# EAGLE design permamote (EAGLE 9.1.1)
AUTHOR: NEAL JACKSON; REV: B; TITLE: PERMAMOTE

## Sheet 1 of 4
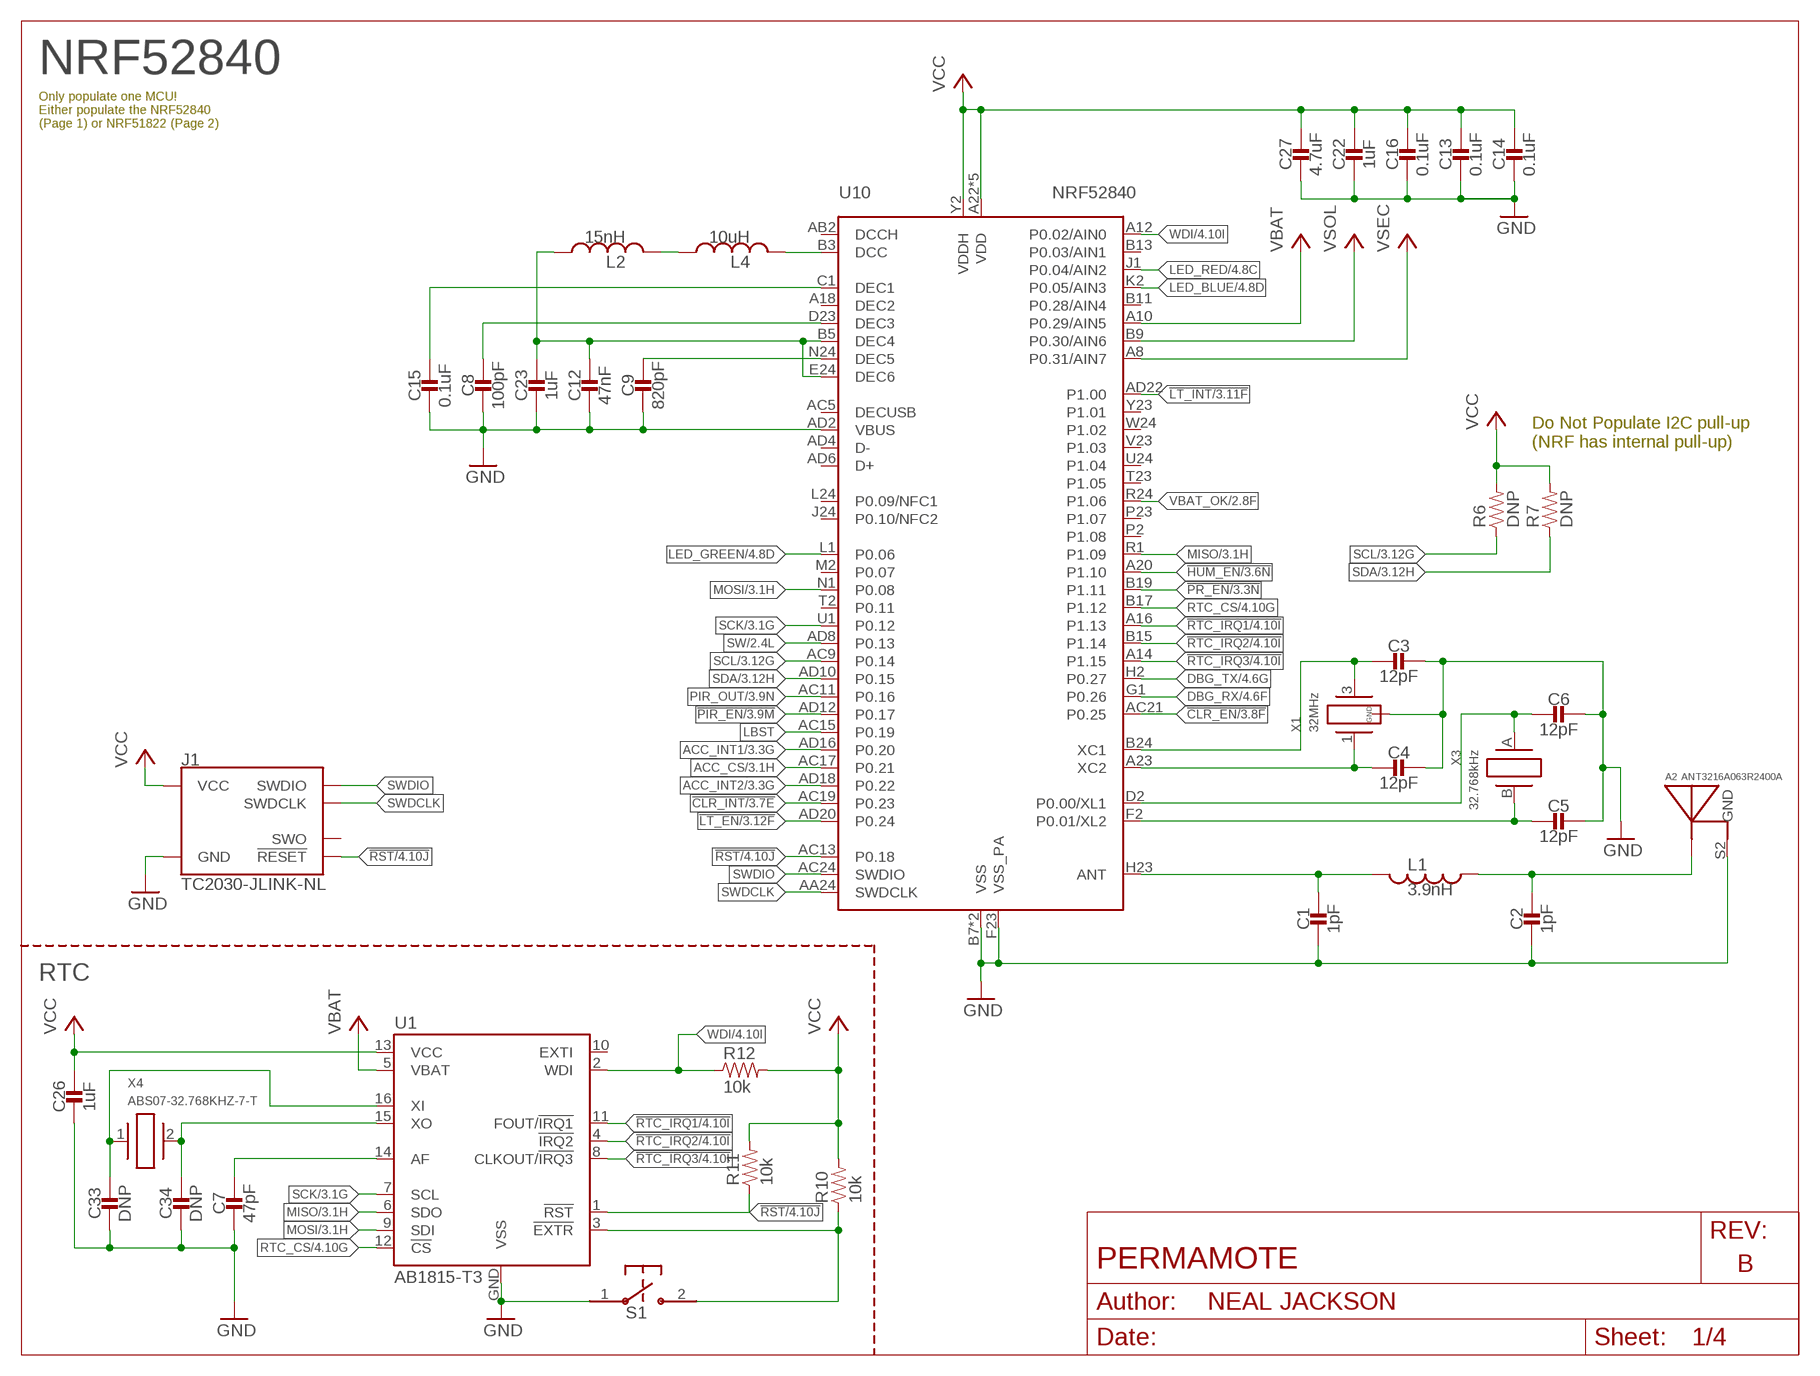
[diagram p0: schematic, sheet 1]

### Parts
A2  ANT3216A063R2400A  [ANT3216A063R2400A]
C1  1pF  CAPACITOR0402_CAP  [0402_CAP]
C2  1pF  CAPACITOR0402_CAP  [0402_CAP]
C3  12pF  CAPACITOR0402_CAP  [0402_CAP]
C4  12pF  CAPACITOR0402_CAP  [0402_CAP]
C5  12pF  CAPACITOR0402_CAP  [0402_CAP]
C6  12pF  CAPACITOR0402_CAP  [0402_CAP]
C7  47pF  CAPACITOR0402_CAP  [0402_CAP]
C8  100pF  CAPACITOR0402_CAP  [0402_CAP]
C9  820pF  CAPACITOR0402_CAP  [0402_CAP]
C12  47nF  CAPACITOR0402_CAP  [0402_CAP]
C13  0.1uF  CAPACITOR0402_CAP  [0402_CAP]
C14  0.1uF  CAPACITOR0402_CAP  [0402_CAP]
C15  0.1uF  CAPACITOR0402_CAP  [0402_CAP]
C16  0.1uF  CAPACITOR0402_CAP  [0402_CAP]
C22  1uF  CAPACITOR0402_CAP  [0402_CAP]
C23  1uF  CAPACITOR0402_CAP  [0402_CAP]
C26  1uF  CAPACITOR0402_CAP  [0402_CAP]
C27  4.7uF  CAPACITOR0402_CAP  [0402_CAP]
C33  DNP  CAPACITOR0402_CAP  [0402_CAP]
C34  DNP  CAPACITOR0402_CAP  [0402_CAP]
J1  TC2030-JLINK-NL  [TC2030-IDC-NL]
L1  3.9nH  INDUCTOR0402  [0402_CAP]
L2  15nH  INDUCTOR0402  [0402_CAP]
L4  10uH  INDUCTOR0603  [0603_CAP]
R6  DNP  RESISTOR0402_RES  [0402_RES]
R7  DNP  RESISTOR0402_RES  [0402_RES]
R10  10k  RESISTOR0402_RES  [0402_RES]
R11  10k  RESISTOR0402_RES  [0402_RES]
R12  10k  RESISTOR0402_RES  [0402_RES]
S1  B3U-1000P  [B3U-1000P]
U1  AB1815-T3  [QFN-16-3MM]
U10  NRF52840  [AQFN73]
X1  32MHz  7V-32.000MAHV-T  [TXC-7V]
X3  32.768kHz  ABS05-32.768KHZ-9-T  [ABS05]
X4  ABS07-32.768KHZ-7-T  [2-SMD]

### Nets
!CLR_EN: U10.AC21(P0.25) ; also sheet 3,4
!CLR_INT: U10.AC19(P0.23) ; also sheet 3,4
!HUM_EN: U10.A20(P1.10) ; also sheet 3,4
!LT_EN: U10.AD20(P0.24) ; also sheet 3,4
!LT_INT: U10.AD22(P1.00) ; also sheet 3,4
!PIR_EN: U10.AD12(P0.17) ; also sheet 3,4
!PR_EN: U10.B19(P1.11) ; also sheet 3,4
!RST: J1.3(!RESET) R11.1 U1.1(!RST) U10.AC13(P0.18) ; also sheet 4
!RTC_EXTR: R10.1 S1.2 U1.3(!EXTR)
!RTC_IRQ1: U1.11(FOUT/!IRQ1) U10.A16(P1.13) ; also sheet 4
!RTC_IRQ2: U1.4(!IRQ2) U10.B15(P1.14) ; also sheet 4
!RTC_IRQ3: U1.8(CLKOUT/!IRQ3) U10.A14(P1.15) ; also sheet 4
ACC_CS: U10.AC17(P0.21) ; also sheet 3,4
ACC_INT1: U10.AD16(P0.20) ; also sheet 3,4
ACC_INT2: U10.AD18(P0.22) ; also sheet 3,4
DBG_RX: U10.G1(P0.26) ; also sheet 4
DBG_TX: U10.H2(P0.27) ; also sheet 4
GND: A2.S2(GND) C1.2 C2.2 C3.1 C4.1 C5.1 C6.1 C7.2 C8.2 C9.2 C12.2 C13.2 C14.2 C15.2 C16.2 C22.2 C23.2 C26.2 C27.2 C33.2 C34.2 J1.5(GND) S1.1 U1.GND(VSS) U10.AD2(VBUS) U10.B7(VSS) U10.F23(VSS_PA) U10.GND(VSS) X1.2(GND) X1.4(GND) ; also sheet 2,3,4
LBST: U10.AC15(P0.19) ; also sheet 2
LED_BLUE: U10.K2(P0.05/AIN3) ; also sheet 4
LED_GREEN: U10.L1(P0.06) ; also sheet 4
LED_RED: U10.J1(P0.04/AIN2) ; also sheet 4
MISO: U1.6(SDO) U10.R1(P1.09) ; also sheet 3,4
MOSI: U1.9(SDI) U10.N1(P0.08) ; also sheet 3,4
N$1: C9.1 U10.N24(DEC5)
N$2: C15.1 U10.C1(DEC1)
N$3: C12.1 C23.1 L2.1 U10.B5(DEC4) U10.E24(DEC6)
N$4: C8.1 U10.D23(DEC3)
N$5: C1.1 L1.2 U10.H23(ANT)
N$6: A2.S1(ANTENNA) C2.1 L1.1
N$8: C3.2 U10.B24(XC1) X1.3
N$9: C4.2 U10.A23(XC2) X1.1
N$25: C7.1 U1.14(AF)
N$26: C33.1 U1.16(XI) X4.1
N$27: C34.1 U1.15(XO) X4.2
N$44: L4.2 U10.B3(DCC)
N$49: L2.2 L4.1
PIR_OUT: U10.AC11(P0.16) ; also sheet 3,4
RTC_CS: U1.12(!CS) U10.B17(P1.12) ; also sheet 4
SCK: U1.7(SCL) U10.U1(P0.12) ; also sheet 3,4
SCL: R6.1 U10.AC9(P0.14) ; also sheet 3,4
SDA: R7.1 U10.AD10(P0.15) ; also sheet 3,4
SW: U10.AD8(P0.13) ; also sheet 2,4
SWDCLK: J1.4(SWDCLK) U10.AA24(SWDCLK)
SWDIO: J1.2(SWDIO) U10.AC24(SWDIO)
VBAT: U1.5(VBAT) U10.A10(P0.29/AIN5) ; also sheet 2
VBAT_OK: U10.R24(P1.06) ; also sheet 2
VCC: C13.1 C14.1 C16.1 C22.1 C26.1 C27.1 J1.1(VCC) R6.2 R7.2 R10.2 R11.2 R12.2 U1.13(VCC) U10.A22(VDD) U10.AD14(VDD) U10.AD23(VDD) U10.B1(VDD) U10.W1(VDD) U10.Y2(VDDH) ; also sheet 2,3,4
VSEC: U10.A8(P0.31/AIN7) ; also sheet 2,4
VSOL: U10.B9(P0.30/AIN6) ; also sheet 2,4
WDI: R12.1 U1.2(WDI) U10.A12(P0.02/AIN0) ; also sheet 4
XL1: C6.2 U10.D2(P0.00/XL1) X3.A
XL2: C5.2 U10.F2(P0.01/XL2) X3.B
Unconnected: J1.6(SWO) U1.10(EXTI) U10.A18(DEC2) U10.AB2(DCCH) U10.AC5(DECUSB) U10.AD4(D-) U10.AD6(D+) U10.B11(P0.28/AIN4) U10.B13(P0.03/AIN1) U10.J24(P0.10/NFC2) U10.L24(P0.09/NFC1) U10.M2(P0.07) U10.P2(P1.08) U10.P23(P1.07) U10.T2(P0.11) U10.T23(P1.05) U10.U24(P1.04) U10.V23(P1.03) U10.W24(P1.02) U10.Y23(P1.01)

### Notes on the sheet
- NRF52840
- Only populate one MCU!
  Either populate the NRF52840
  (Page 1) or NRF51822 (Page 2)
- Do Not Populate I2C pull-up
  (NRF has internal pull-up)
- RTC

## Sheet 2 of 4
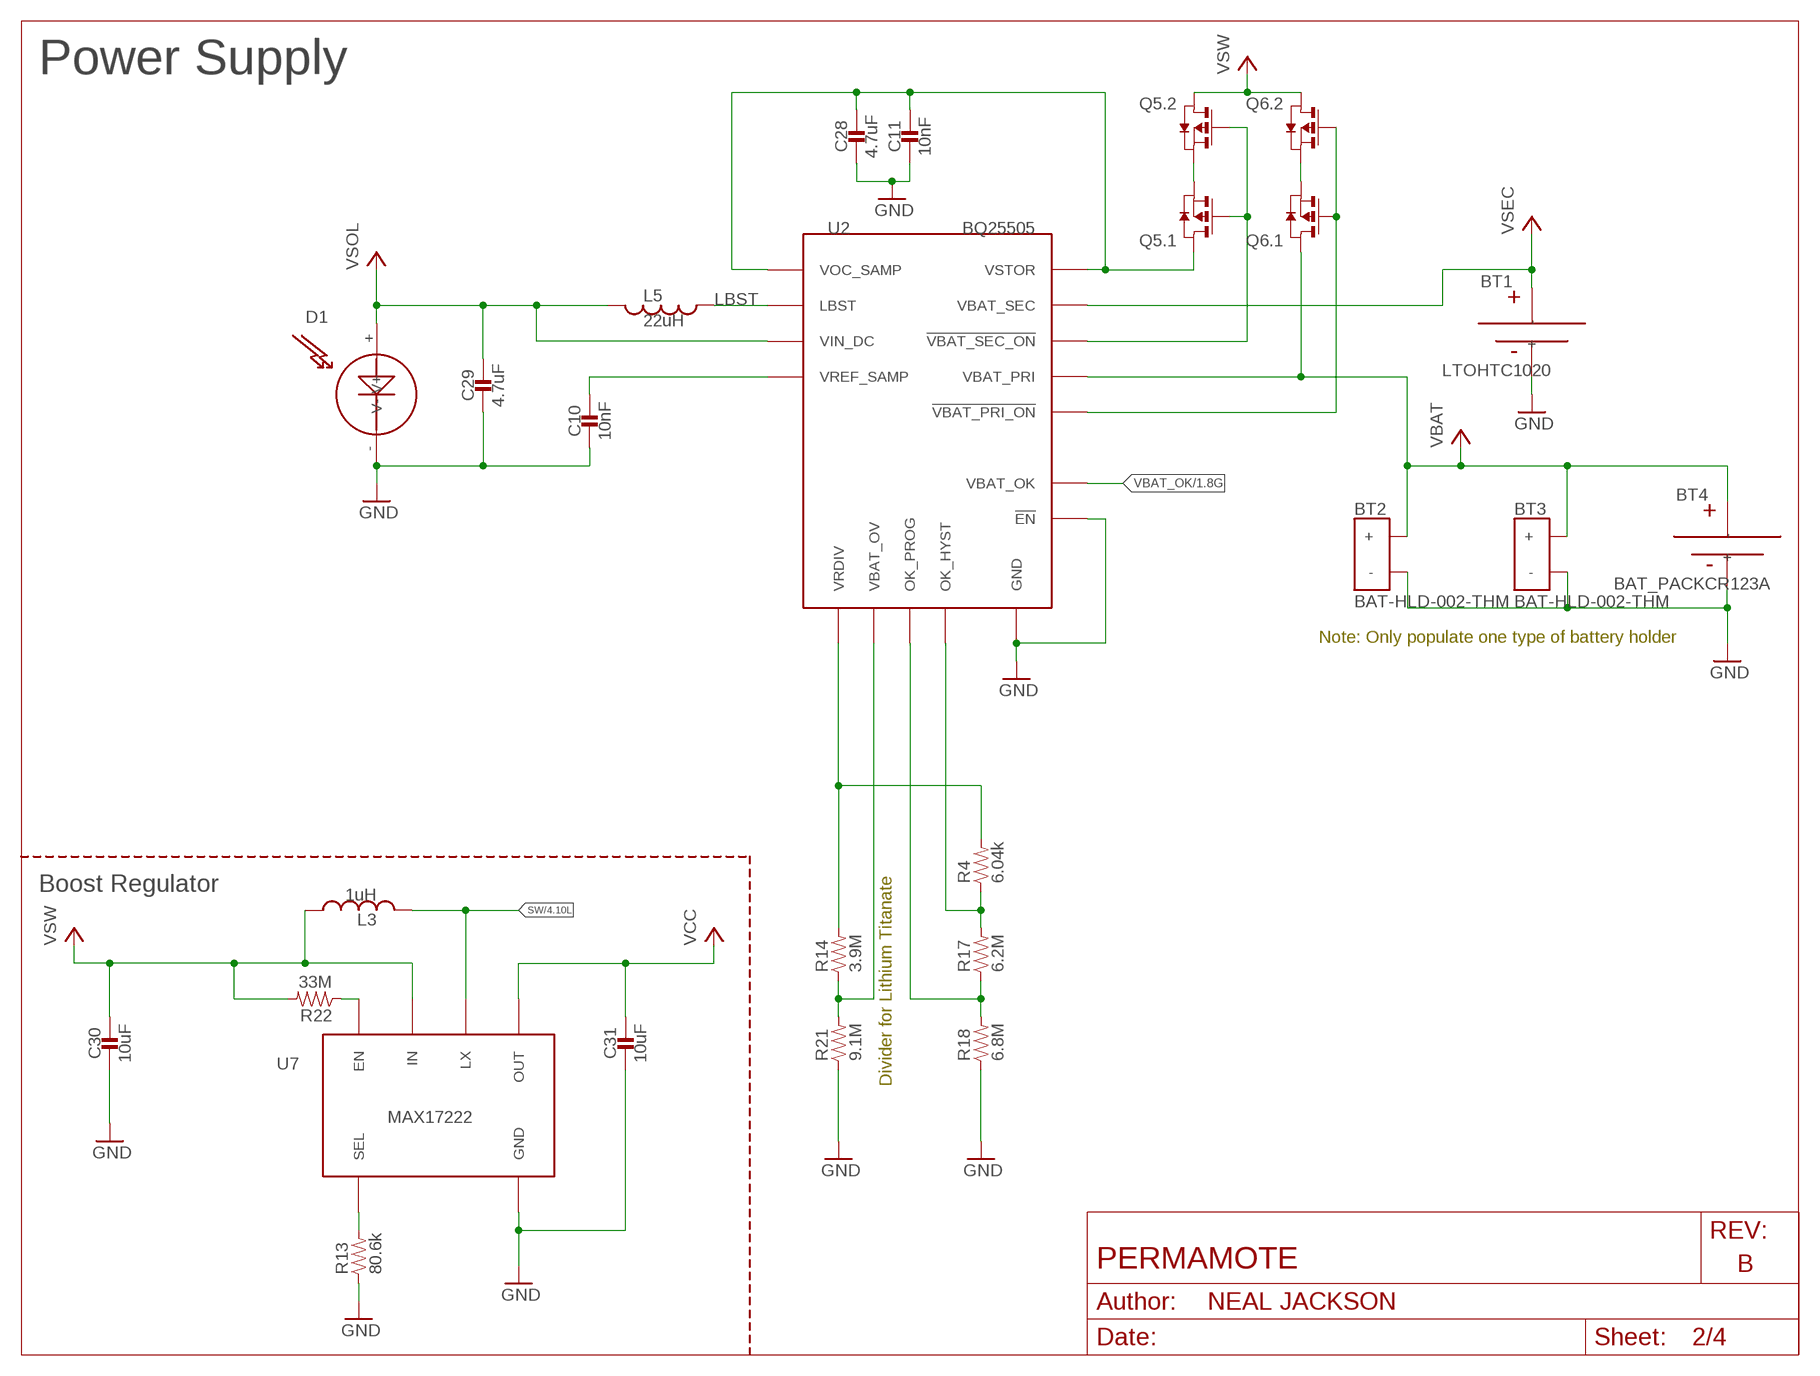
[diagram p1: schematic, sheet 2]

### Parts
BT1  LTOHTC1020  [1020]
BT2  BAT-HLD-002-THM  [BAT-HLD-002-THM]
BT3  BAT-HLD-002-THM  [BAT-HLD-002-THM]
BT4  BAT_PACKCR123A  [BH123A]
C10  10nF  CAPACITOR0402_CAP  [0402_CAP]
C11  10nF  CAPACITOR0402_CAP  [0402_CAP]
C28  4.7uF  CAPACITOR0402_CAP  [0402_CAP]
C29  4.7uF  CAPACITOR0402_CAP  [0402_CAP]
C30  10uF  CAPACITOR0603_CAP  [0603_CAP]
C31  10uF  CAPACITOR0603_CAP  [0603_CAP]
D1  SOLARCELLHOLES  [SOLAR_HOLES]
L3  1uH  INDUCTORIHL  [IHL-1212BZ-11]
L5  22uH  INDUCTOR74437324220  [74437324220]
Q5  PMDXB950UPEL  [XDFN-6]
Q6  PMDXB950UPEL  [XDFN-6]
R4  6.04k  RESISTOR0402_RES  [0402_RES]
R13  80.6k  RESISTOR0603_RES  [0603-RES]
R14  3.9M  RESISTOR0402_RES  [0402_RES]
R17  6.2M  RESISTOR0402_RES  [0402_RES]
R18  6.8M  RESISTOR0402_RES  [0402_RES]
R21  9.1M  RESISTOR0402_RES  [0402_RES]
R22  33M  RESISTOR0603_RES  [0603-RES]
U2  BQ25505  [S-PVQFN-N20-RGR]
U7  MAX17222  [UDFN-6-MAXIM]

### Nets
!VBAT_PRI_ON: Q6.2(.1:G) Q6.5(.2:G) U2.10(!VBAT_PRI_ON)
!VBAT_SEC_ON: Q5.2(.1:G) Q5.5(.2:G) U2.9(!VBAT_SEC_ON)
GND: BT1.- BT2.GND(-) BT3.GND(-) BT4.- C10.2 C11.2 C28.2 C29.2 C30.2 C31.2 D1.-(V-) R13.1 R18.1 R21.1 U2.1(GND) U2.5(!EN) U2.6(GND) U2.15(GND) U2.16(GND) U2.17(GND) U2.PAD(GND) U7.3(GND) ; also sheet 1,3,4
LBST: L5.P$1 U2.20(LBST) ; also sheet 1
N$12: R13.2 U7.4(SEL)
N$14: R22.1 U7.6(EN)
N$18: R14.1 R21.2 U2.7(VBAT_OV)
N$32: R4.2 R14.2 U2.8(VRDIV)
N$45: Q5.1(.1:S) Q5.4(.2:S)
N$53: Q6.1(.1:S) Q6.4(.2:S)
N$57: R17.1 R18.2 U2.12(OK_PROG)
N$58: R4.1 R17.2 U2.11(OK_HYST)
SW: L3.P$2 U7.2(LX) ; also sheet 1,4
VBAT: BT2.POS1(+) BT2.POS2(+) BT2.POS3(+) BT2.POS4(+) BT3.POS1(+) BT3.POS2(+) BT3.POS3(+) BT3.POS4(+) BT4.+ Q6.6(.1:D) U2.14(VBAT_PRI) ; also sheet 1
VBAT_OK: U2.13(VBAT_OK) ; also sheet 1
VCC: C31.1 U7.1(OUT) ; also sheet 1,3,4
VOC_SAMP_VSTOR: C11.1 C28.1 Q5.6(.1:D) U2.3(VOC_SAMP) U2.19(VSTOR)
VREF_SAMP: C10.1 U2.4(VREF_SAMP)
VSEC: BT1.+ U2.18(VBAT_SEC) ; also sheet 1,4
VSOL: C29.1 D1.+(V+) L5.P$2 U2.2(VIN_DC) ; also sheet 1,4
VSW: C30.1 L3.P$1 Q5.3(.2:D) Q6.3(.2:D) R22.2 U7.5(IN)

### Notes on the sheet
- Power Supply
- Note: Only populate one type of battery holder
- Boost Regulator
- Divider for Lithium Titanate

## Sheet 3 of 4
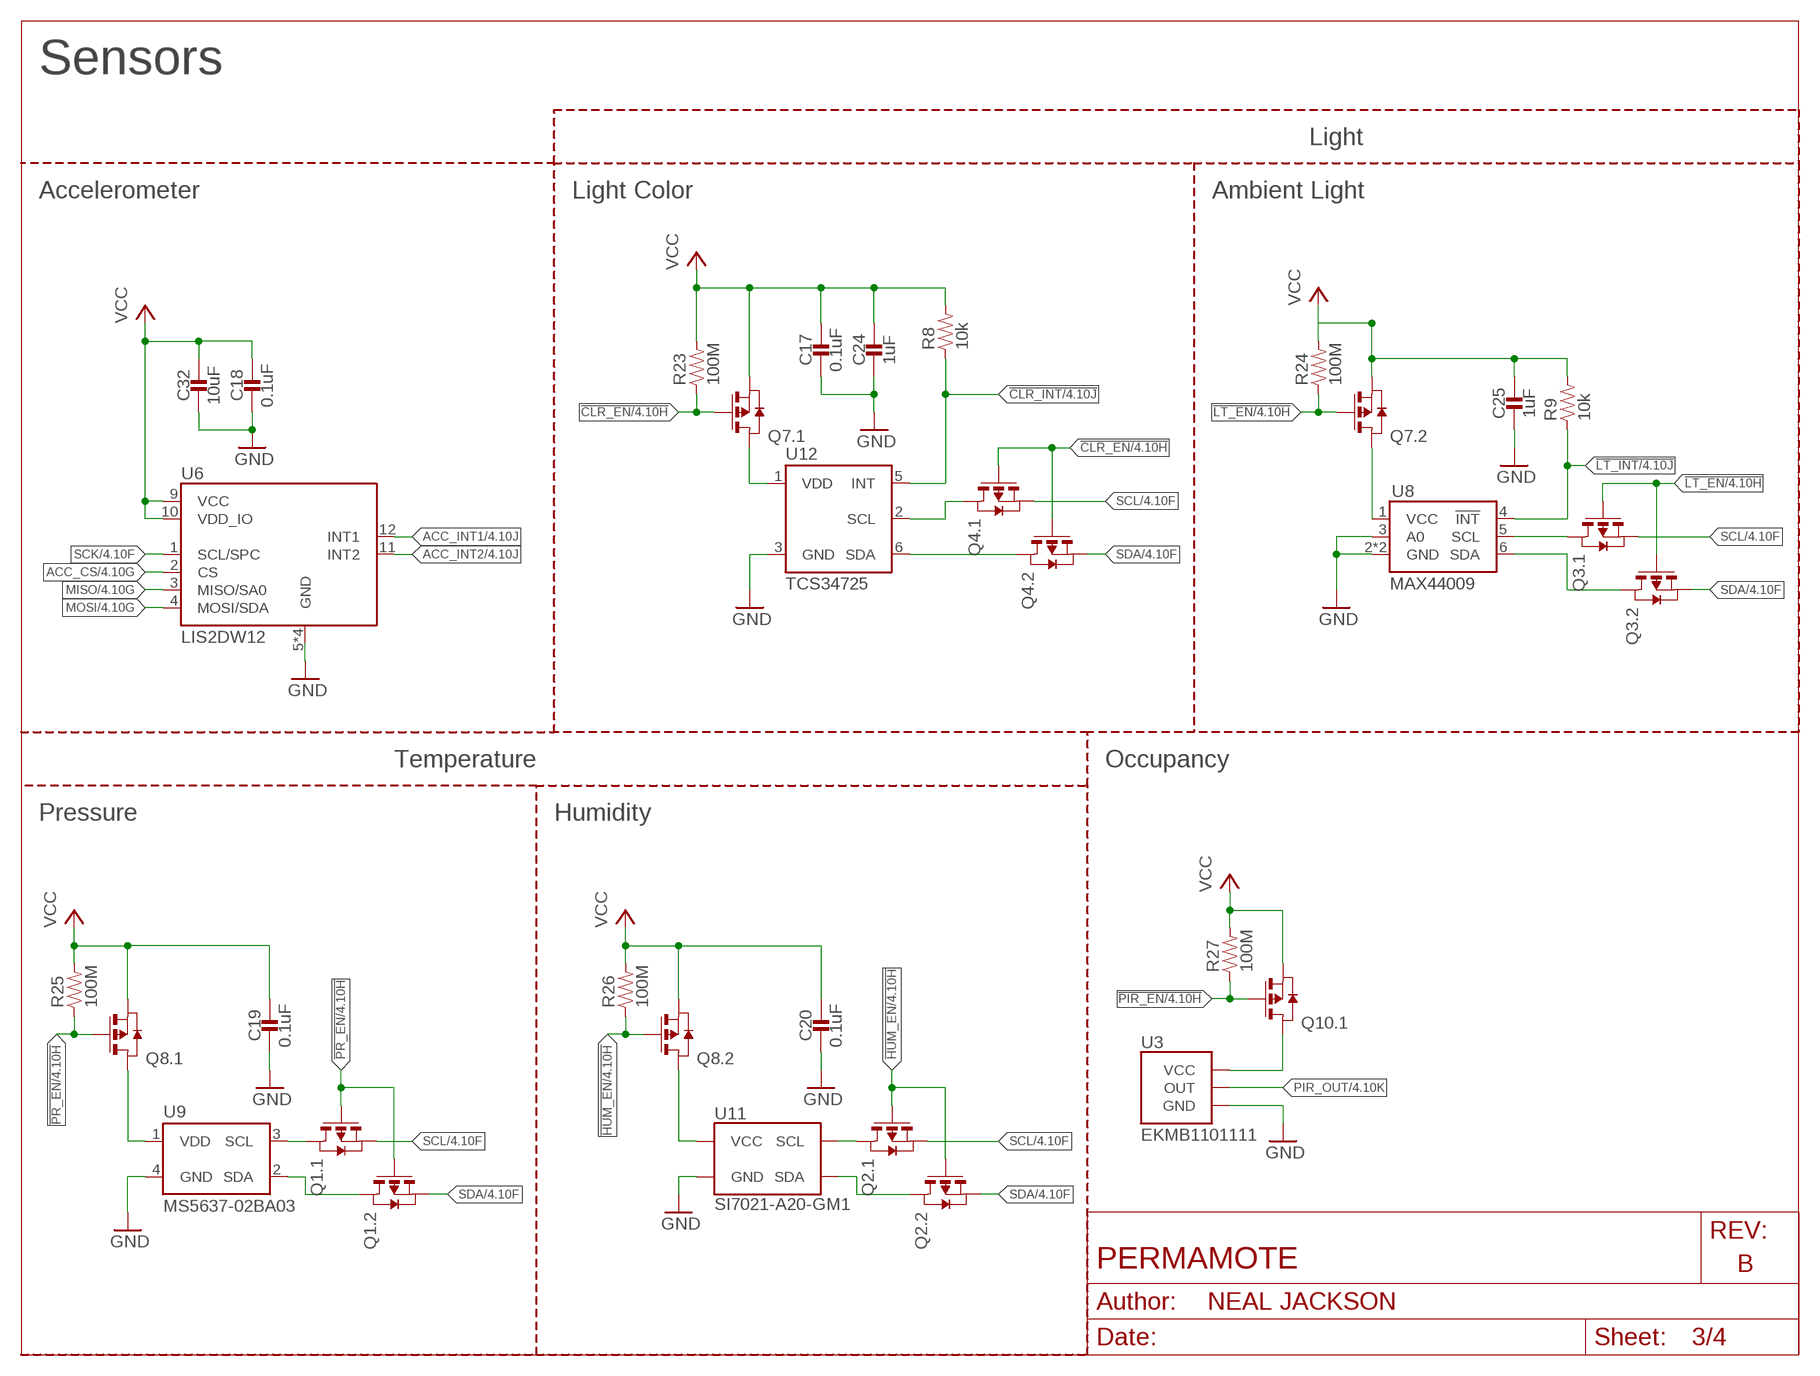
[diagram p2: schematic, sheet 3]

### Parts
C17  0.1uF  CAPACITOR0402_CAP  [0402_CAP]
C18  0.1uF  CAPACITOR0402_CAP  [0402_CAP]
C19  0.1uF  CAPACITOR0402_CAP  [0402_CAP]
C20  0.1uF  CAPACITOR0402_CAP  [0402_CAP]
C24  1uF  CAPACITOR0402_CAP  [0402_CAP]
C25  1uF  CAPACITOR0402_CAP  [0402_CAP]
C32  10uF  CAPACITOR0603_CAP  [0603_CAP]
Q1  PMDXB950UPEL  [XDFN-6]
Q2  PMDXB950UPEL  [XDFN-6]
Q3  PMDXB950UPEL  [XDFN-6]
Q4  PMDXB950UPEL  [XDFN-6]
Q7  PMDXB950UPEL  [XDFN-6]
Q8  PMDXB950UPEL  [XDFN-6]
Q10  PMDXB950UPEL  [XDFN-6]
R8  10k  RESISTOR0402_RES  [0402_RES]
R9  10k  RESISTOR0402_RES  [0402_RES]
R23  100M  RESISTOR0402_RES  [0402_RES]
R24  100M  RESISTOR0402_RES  [0402_RES]
R25  100M  RESISTOR0402_RES  [0402_RES]
R26  100M  RESISTOR0402_RES  [0402_RES]
R27  100M  RESISTOR0402_RES  [0402_RES]
U3  EKMB1101111  [AMN2]
U6  LIS2DW12  [LGA-12]
U8  MAX44009  [UDFN-6-EXPOSED]
U9  MS5637-02BA03  [4-SMD]
U11  SI7021-A20-GM1  [DFN-6/3MM]
U12  TCS34725  [FN-6]

### Nets
!CLR_EN: Q4.2(.1:G) Q4.5(.2:G) Q7.2(.1:G) R23.1 ; also sheet 1,4
!CLR_INT: R8.1 U12.5(INT) ; also sheet 1,4
!HUM_EN: Q2.2(.1:G) Q2.5(.2:G) Q8.5(.2:G) R26.1 ; also sheet 1,4
!LT_EN: Q3.2(.1:G) Q3.5(.2:G) Q7.5(.2:G) R24.1 ; also sheet 1,4
!LT_INT: R9.1 U8.4(!INT) ; also sheet 1,4
!PIR_EN: Q10.2(.1:G) R27.1 ; also sheet 1,4
!PR_EN: Q1.2(.1:G) Q1.5(.2:G) Q8.2(.1:G) R25.1 ; also sheet 1,4
ACC_CS: U6.2(CS) ; also sheet 1,4
ACC_INT1: U6.12(INT1) ; also sheet 1,4
ACC_INT2: U6.11(INT2) ; also sheet 1,4
GND: C17.2 C18.2 C19.2 C20.2 C24.2 C25.2 C32.2 U3.GND U6.5(GND) U6.6(GND) U6.7(GND) U6.8(GND) U8.2(GND) U8.3(A0) U8.EP(GND) U9.4(GND) U11.2(GND) U12.3(GND) ; also sheet 1,2,4
MISO: U6.3(MISO/SA0) ; also sheet 1,4
MOSI: U6.4(MOSI/SDA) ; also sheet 1,4
N$20: Q7.3(.2:D) U8.1(VCC)
N$21: Q8.6(.1:D) U9.1(VDD)
N$22: Q8.3(.2:D) U11.5(VCC)
N$23: Q10.6(.1:D) U3.VCC
N$31: Q7.6(.1:D) U12.1(VDD)
N$34: Q1.6(.1:D) U9.3(SCL)
N$41: Q1.3(.2:D) U9.2(SDA)
N$48: Q2.3(.2:D) U11.1(SDA)
N$50: Q2.6(.1:D) U11.6(SCL)
N$51: Q3.3(.2:D) U8.6(SDA)
N$52: Q3.6(.1:D) U8.5(SCL)
N$54: Q4.3(.2:D) U12.6(SDA)
N$55: Q4.6(.1:D) U12.2(SCL)
PIR_OUT: U3.OUT ; also sheet 1,4
SCK: U6.1(SCL/SPC) ; also sheet 1,4
SCL: Q1.1(.1:S) Q2.1(.1:S) Q3.1(.1:S) Q4.1(.1:S) ; also sheet 1,4
SDA: Q1.4(.2:S) Q2.4(.2:S) Q3.4(.2:S) Q4.4(.2:S) ; also sheet 1,4
VCC: C17.1 C18.1 C19.1 C20.1 C24.1 C25.1 C32.1 Q7.1(.1:S) Q7.4(.2:S) Q8.1(.1:S) Q8.4(.2:S) Q10.1(.1:S) R8.2 R9.2 R23.2 R24.2 R25.2 R26.2 R27.2 U6.9(VCC) U6.10(VDD_IO) ; also sheet 1,2,4
Unconnected: Q10.3(.2:D) Q10.4(.2:S) Q10.5(.2:G)

### Notes on the sheet
- Sensors
- Light
- Accelerometer | Light Color | Ambient Light
- Temperature | Occupancy
- Pressure | Humidity

## Sheet 4 of 4
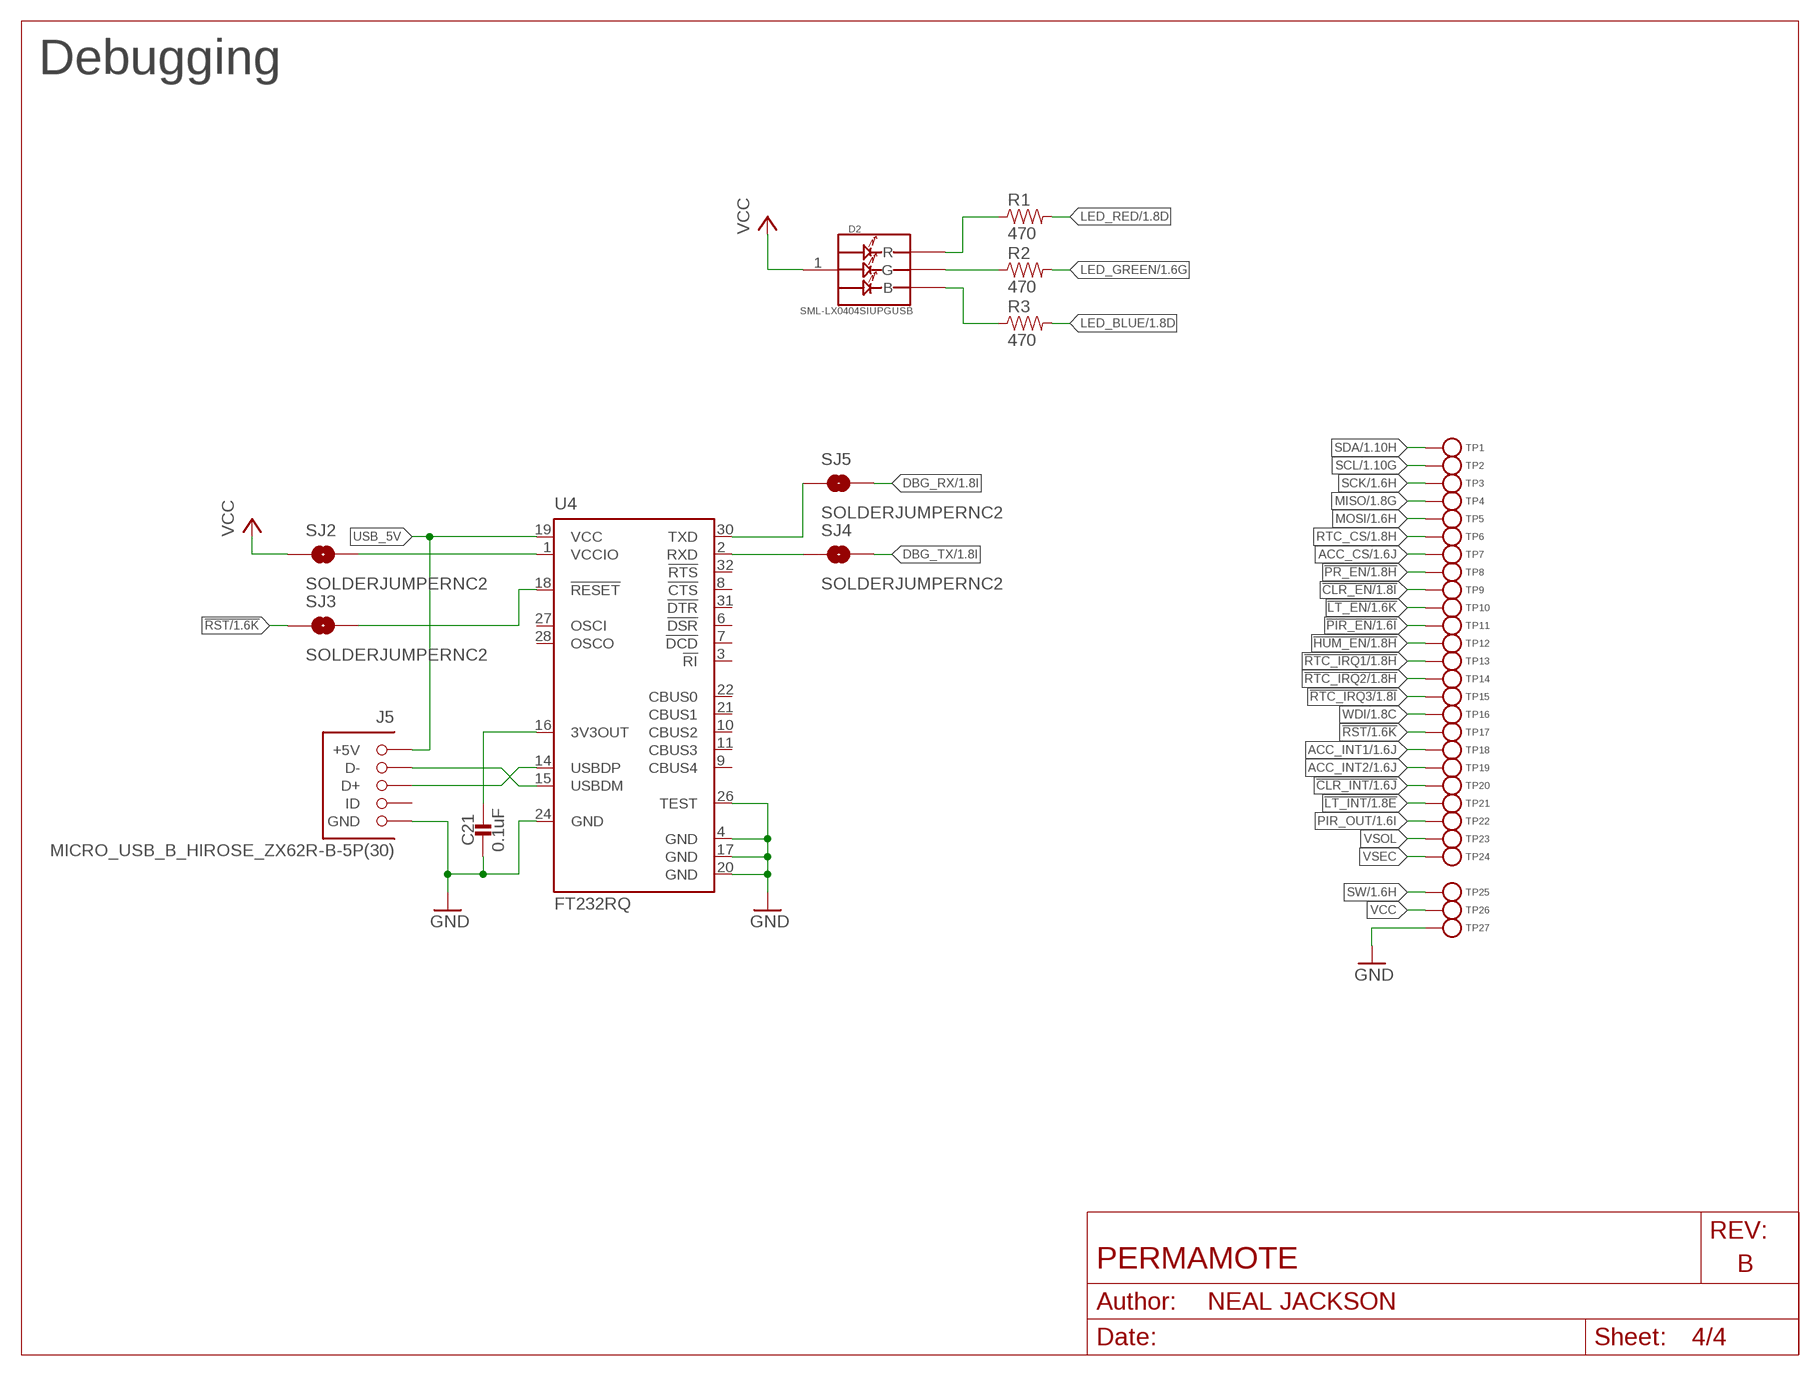
[diagram p3: schematic, sheet 4]

### Parts
C21  0.1uF  CAPACITOR0402_CAP  [0402_CAP]
D2  SML-LX0404SIUPGUSB  [1MM_SQ_4PAD]
J5  MICRO_USB_B_HIROSE_ZX62R-B-5P(30)  [MICRO_USB_B_HIROSE_ZX62R-B-5P(30)]
R1  470  RESISTOR0402_RES  [0402_RES]
R2  470  RESISTOR0402_RES  [0402_RES]
R3  470  RESISTOR0402_RES  [0402_RES]
SJ2  SOLDERJUMPERNC2  [SJ_2S-NOTRACE]
SJ3  SOLDERJUMPERNC2  [SJ_2S-NOTRACE]
SJ4  SOLDERJUMPERNC2  [SJ_2S-NOTRACE]
SJ5  SOLDERJUMPERNC2  [SJ_2S-NOTRACE]
TP1  TEST-POINT  [PAD.03X.03]
TP2  TEST-POINT  [PAD.03X.03]
TP3  TEST-POINT  [PAD.03X.03]
TP4  TEST-POINT  [PAD.03X.03]
TP5  TEST-POINT  [PAD.03X.03]
TP6  TEST-POINT  [PAD.03X.03]
TP7  TEST-POINT  [PAD.03X.03]
TP8  TEST-POINT  [PAD.03X.03]
TP9  TEST-POINT  [PAD.03X.03]
TP10  TEST-POINT  [PAD.03X.03]
TP11  TEST-POINT  [PAD.03X.03]
TP12  TEST-POINT  [PAD.03X.03]
TP13  TEST-POINT  [PAD.03X.03]
TP14  TEST-POINT  [PAD.03X.03]
TP15  TEST-POINT  [PAD.03X.03]
TP16  TEST-POINT  [PAD.03X.03]
TP17  TEST-POINT  [PAD.03X.03]
TP18  TEST-POINT  [PAD.03X.03]
TP19  TEST-POINT  [PAD.03X.03]
TP20  TEST-POINT  [PAD.03X.03]
TP21  TEST-POINT  [PAD.03X.03]
TP22  TEST-POINT  [PAD.03X.03]
TP23  TEST-POINT  [PAD.03X.03]
TP24  TEST-POINT  [PAD.03X.03]
TP25  TEST-POINT  [PAD.03X.03]
TP26  TEST-POINT  [PAD.03X.03]
TP27  TEST-POINT  [PAD.03X.03]
U4  FT232RQ  [QFN32]

### Nets
!CLR_EN: TP9.P$1(TESTPOINT) ; also sheet 1,3
!CLR_INT: TP20.P$1(TESTPOINT) ; also sheet 1,3
!FTDI_RESET: SJ3.2 U4.18(!RESET)
!HUM_EN: TP12.P$1(TESTPOINT) ; also sheet 1,3
!LT_EN: TP10.P$1(TESTPOINT) ; also sheet 1,3
!LT_INT: TP21.P$1(TESTPOINT) ; also sheet 1,3
!PIR_EN: TP11.P$1(TESTPOINT) ; also sheet 1,3
!PR_EN: TP8.P$1(TESTPOINT) ; also sheet 1,3
!RST: SJ3.1 TP17.P$1(TESTPOINT) ; also sheet 1
!RTC_IRQ1: TP13.P$1(TESTPOINT) ; also sheet 1
!RTC_IRQ2: TP14.P$1(TESTPOINT) ; also sheet 1
!RTC_IRQ3: TP15.P$1(TESTPOINT) ; also sheet 1
ACC_CS: TP7.P$1(TESTPOINT) ; also sheet 1,3
ACC_INT1: TP18.P$1(TESTPOINT) ; also sheet 1,3
ACC_INT2: TP19.P$1(TESTPOINT) ; also sheet 1,3
D+: J5.3(D+) U4.14(USBDP)
D-: J5.2(D-) U4.15(USBDM)
DBG_RX: SJ5.2 ; also sheet 1
DBG_TX: SJ4.2 ; also sheet 1
FTDI_VCCIO: SJ2.2 U4.1(VCCIO)
GND: C21.2 J5.5(GND) TP27.P$1(TESTPOINT) U4.4(GND) U4.17(GND) U4.20(GND) U4.24(GND) U4.26(TEST) ; also sheet 1,2,3
LED_BLUE: R3.2 ; also sheet 1
LED_GREEN: R2.2 ; also sheet 1
LED_RED: R1.2 ; also sheet 1
MISO: TP4.P$1(TESTPOINT) ; also sheet 1,3
MOSI: TP5.P$1(TESTPOINT) ; also sheet 1,3
N$13: C21.1 U4.16(3V3OUT)
N$15: D2.2(R) R1.1
N$17: D2.4(G) R2.1
N$19: D2.3(B) R3.1
PIR_OUT: TP22.P$1(TESTPOINT) ; also sheet 1,3
RTC_CS: TP6.P$1(TESTPOINT) ; also sheet 1
RXD: SJ4.1 U4.2(RXD)
SCK: TP3.P$1(TESTPOINT) ; also sheet 1,3
SCL: TP2.P$1(TESTPOINT) ; also sheet 1,3
SDA: TP1.P$1(TESTPOINT) ; also sheet 1,3
SW: TP25.P$1(TESTPOINT) ; also sheet 1,2
TXD: SJ5.1 U4.30(TXD)
USB_5V: J5.1(+5V) U4.19(VCC)
VCC: D2.1(VDD) SJ2.1 TP26.P$1(TESTPOINT) ; also sheet 1,2,3
VSEC: TP24.P$1(TESTPOINT) ; also sheet 1,2
VSOL: TP23.P$1(TESTPOINT) ; also sheet 1,2
WDI: TP16.P$1(TESTPOINT) ; also sheet 1
Unconnected: J5.4(ID) U4.3(!RI) U4.6(!DSR) U4.7(!DCD) U4.8(!CTS) U4.9(CBUS4) U4.10(CBUS2) U4.11(CBUS3) U4.21(CBUS1) U4.22(CBUS0) U4.27(OSCI) U4.28(OSCO) U4.31(!DTR) U4.32(!RTS)

### Notes on the sheet
- Debugging

## Library data of the parts
A2 = chips:ANT3216A063R2400A: Yageo 2.4GHz WiFi/Bluetooth/Zigbee/ISM Chip Antenna; DIGIKEY: 311-1542-1-ND; MANUFACTURER: YAGEO; MPN: ANT3216A063R2400A
BT1 = batteries:LTOHTC
BT2 BT3 = batteries:BAT-HLD-002-THM: RETAINER BATT CR2016 PC PINS; DIGIKEY: BAT-HLD-001-THM-ND; MOUSER: 712-BAT-HLD-001-THM; MPN: BAT-HLD-001-THM
BT4 = batteries:BAT_PACK: collection of battery footprints; DIGIKEY: BH123A-ND; MANUFACTURER: MPD; MPN: BH123A
C1 C2 = passives:CAPACITOR: SMD Capacitor; DIGIKEY: 1276-1595-1-ND; MPN: CL05C010CB5NNNC
C3-C6 = passives:CAPACITOR: SMD Capacitor; DIGIKEY: 490-6197-1-ND; MPN: GRM1555C1H120GA01D
C7 = passives:CAPACITOR: SMD Capacitor; DIGIKEY: 490-5942-1-ND; MPN: GRM1555C1H470JA01D
C8 = passives:CAPACITOR: SMD Capacitor; DIGIKEY: 490-5922-1-ND; MPN: GRM1555C1H101JA01D
C9 = passives:CAPACITOR: SMD Capacitor; DIGIKEY: 1276-6535-1-ND; MPN: CL05B821KO5NNNC
C10 C11 = passives:CAPACITOR: SMD Capacitor; DIGIKEY: 490-4516-1-ND; MPN: GRM155R71H103KA88D
C12 = passives:CAPACITOR: SMD Capacitor; DIGIKEY: 445-1264-1-ND; MPN: C1005X7R1C473K050BC
C13-C21 = passives:CAPACITOR: SMD Capacitor; DIGIKEY: 490-6328-1-ND; MPN: GRM155R71C104KA88J
C22-C26 = passives:CAPACITOR: SMD Capacitor; DIGIKEY: 490-7195-1-ND; MPN: GRM155R70G105KA12D
C27-C29 = passives:CAPACITOR: SMD Capacitor; DIGIKEY: 445-5947-1-ND; MPN: C1005X5R0J475K050BC
C30-C32 = passives:CAPACITOR: SMD Capacitor; DIGIKEY: 490-3896-1-ND; MPN: GRM188R60J106ME47D
C33 C34 = passives:CAPACITOR: SMD Capacitor
D1 = permamote:SOLARCELL: Generic solar cell; DIGIKEY: 869-1001-ND; MPN: AM-1454CA
D2 = leds:SML-LX0404SIUPGUSB: 1mm^2 RGB LED; DIGIKEY: 67-2125-1-ND; MANUFACTURER: Lumex Opto; MPN: SML-LX0404SIUPGUSB
J1 = connector:TC2030-JLINK
J5 = connector:MICRO_USB_B_HIROSE_ZX62R-B-5P(30): USB Micro B Connector Rounded side is up.; DIGIKEY: H125274CT-ND; MOUSER: 798-ZX62R-B-5P30; MPN: ZX62R-B-5P(30); NEWARK: 84Y6712
L1 = passives:INDUCTOR: A very specific inductor; DIGIKEY: 490-1131-1-ND; MPN: LQP15MN3N9B02D
L2 = passives:INDUCTOR: A very specific inductor; DIGIKEY: 587-1521-1-ND; MPN: HK100515NJ-T
L3 = passives:INDUCTOR: A very specific inductor; DIGIKEY: 541-1319-1-ND; MANUFACTURER: Vishay Dale; MPN: IHLP1212BZER1R0M11
L4 = passives:INDUCTOR: A very specific inductor; DIGIKEY: 490-4025-1-ND; MPN: LQM18FN100M00D
L5 = passives:INDUCTOR: A very specific inductor; DIGIKEY: 732-3340-1-ND; MPN: 74437324220
Q1-Q8 Q10 = fets:PMDXB950UPEL: 20 V 500mA, dual P-channel Trench MOSFET; DIGIKEY: 1727-2601-1-ND; MANUFACTURER: NEXPERIA; MPN: PMDXB950UPELZ
R1-R3 = passives:RESISTOR: Resistor Basic schematic elements and footprints for 0201, 0402, 0603, 1206, and PTH resistors.; DIGIKEY: 311-470JRCT-ND; MPN: RC0402JR-07470RL
R4 = passives:RESISTOR: Resistor Basic schematic elements and footprints for 0201, 0402, 0603, 1206, and PTH resistors.; DIGIKEY: YAG2293CT-ND; MPN: RC0402FR-076K04L
R6-R12 = passives:RESISTOR: Resistor Basic schematic elements and footprints for 0201, 0402, 0603, 1206, and PTH resistors.; DIGIKEY: 311-10KJRCT-ND; MPN: RC0402JR-0710KL
R13 = passives:RESISTOR: Resistor Basic schematic elements and footprints for 0201, 0402, 0603, 1206, and PTH resistors.; DIGIKEY: 311-80.6KHRCT-ND; MPN: RC0603FR-0780K6L
R14 = passives:RESISTOR: Resistor Basic schematic elements and footprints for 0201, 0402, 0603, 1206, and PTH resistors.; DIGIKEY: YAG3301CT-ND; MPN: RC0402JR-073M9L
R17 = passives:RESISTOR: Resistor Basic schematic elements and footprints for 0201, 0402, 0603, 1206, and PTH resistors.; DIGIKEY: YAG3309CT-ND; MPN: RC0402JR-076M2L
R18 = passives:RESISTOR: Resistor Basic schematic elements and footprints for 0201, 0402, 0603, 1206, and PTH resistors.; DIGIKEY: YAG3310CT-ND; MPN: RC0402JR-076M8L
R21 = passives:RESISTOR: Resistor Basic schematic elements and footprints for 0201, 0402, 0603, 1206, and PTH resistors.; DIGIKEY: YAG3322CT-ND; MPN: RC0402JR-079M1L
R22 = passives:RESISTOR: Resistor Basic schematic elements and footprints for 0201, 0402, 0603, 1206, and PTH resistors.; DIGIKEY: HMC0603JT33M0CT-ND; MPN: HMC0603JT33M0
R23-R27 = passives:RESISTOR: Resistor Basic schematic elements and footprints for 0201, 0402, 0603, 1206, and PTH resistors.; DIGIKEY: 541-100MAHCT-ND; MPN: HMC0402JT100M
S1 = switches:B3U: Switch; DIGIKEY: SW1020CT-ND; MANUFACTURER: Omron; MPN: B3U-1000P
SJ2-SJ5 = SparkFun-Passives:SOLDERJUMPER: Solder Jumper Standard SMD solder jumper. Used to automate production. Two varients : Normally Open and Normally Closed are the same, but have different paste layers. NC will have a large amount of paste and should jumper during reflow.
TP1-TP27 = headers:TEST-POINT
U1 = chips:AB1815-T3: Ultra-low current RTC. 55nA quiescent @ 3V. 1.5-3.6V input.; DIGIKEY: 535-11936-1-ND; MANUFACTURER: Abracon; MPN: AB1815-T3
U2 = chips:BQ25505: EH front end for switching between primary and secondary cells; DIGIKEY: 296-37078-1-ND; MANUFACTURER: TI; MPN: BQ25505RGRR
U3 = chips:EKMB: Passive infrared human detection sensor with built-in amp.; DIGIKEY: 255-3065-ND; MANUFACTURER: PANASONIC; MPN: EKMB1101111
U4 = ftdichip:FT232R: Source: http://www.ftdichip.com/Documents/DataSheets/DS_FT232R_v104.pdf; MPN: FT232RQ; OC_FARNELL: 1146033; OC_NEWARK: 91K9919
U6 = chips:LIS2DW12: ultra low power 3 axis accelerometer; DIGIKEY: 497-17718-6-ND; MANUFACTURER: STMicroelectronics; MOUSER: 511-LIS2DW12TR; MPN: LIS2DW12TR
U7 = chips:MAX17222: Very high efficiency, very low power boost converter suitable for EH applications; DIGIKEY: MAX17222ELT+TCT-ND; MANUFACTURER: MAXIM INTEGRATED; MPN: MAX17222ELT+T
U8 = chips:MAX44009: low power ambient light sensor; DIGIKEY: MAX44009EDT+TCT-ND; MANUFACTURER: MAXIM; MPN: MAX44009EDT+T
U9 = chips:MS5637-02BA03: low power pressure sensor; DIGIKEY: 223-1199-1-ND; MANUFACTURER: TE CONNECTIVITY; MPN: MS563702BA03-50
U10 = chips:NRF52840: ultra-low power 2.4 GHz wireless system on chip (SoC) integrating a multiprotocol 2.4 GHz transceiver, an ARM® Cortex®-M4F CPU.; DIGIKEY: 1490-1071-1-ND; MANUFACTURER: NORIDIC SEMICONDUCTOR; MPN: NRF52840
U11 = chips:SI7021: IC TEMP SENSOR RH 2% DFN; DIGIKEY: 336-3141-ND; MOUSER: 634-SI7021-A20-GM1; MPN: SI7021-A20-GM1
U12 = chips:TCS34725: Color Light-to-Digital Converter with IR Filter; DIGIKEY: TCS34725FNCT-ND; MPN: TCS34725FN
X1 = crystals:7V: TXC CRYSTAL SMD; DIGIKEY: 887-2568-1-ND; MANUFACTURER: TXC CORPORATION; MPN: 7M-32.000MAHV-T
X3 = crystals:ABS05-32.768KHZ: 32.768kHz Crystal; DIGIKEY: 535-11897-1-ND; MANUFACTURER: Abracon; MPN: ABS05-32.768KHZ-9-T
X4 = crystals:ABS07-32.768KHZ: 32.768kHz Crystal; DIGIKEY: 535-9543-1-ND; MANUFACTURER: ABRACON; MPN: ABS07-32.768KHZ-7-T

## Board
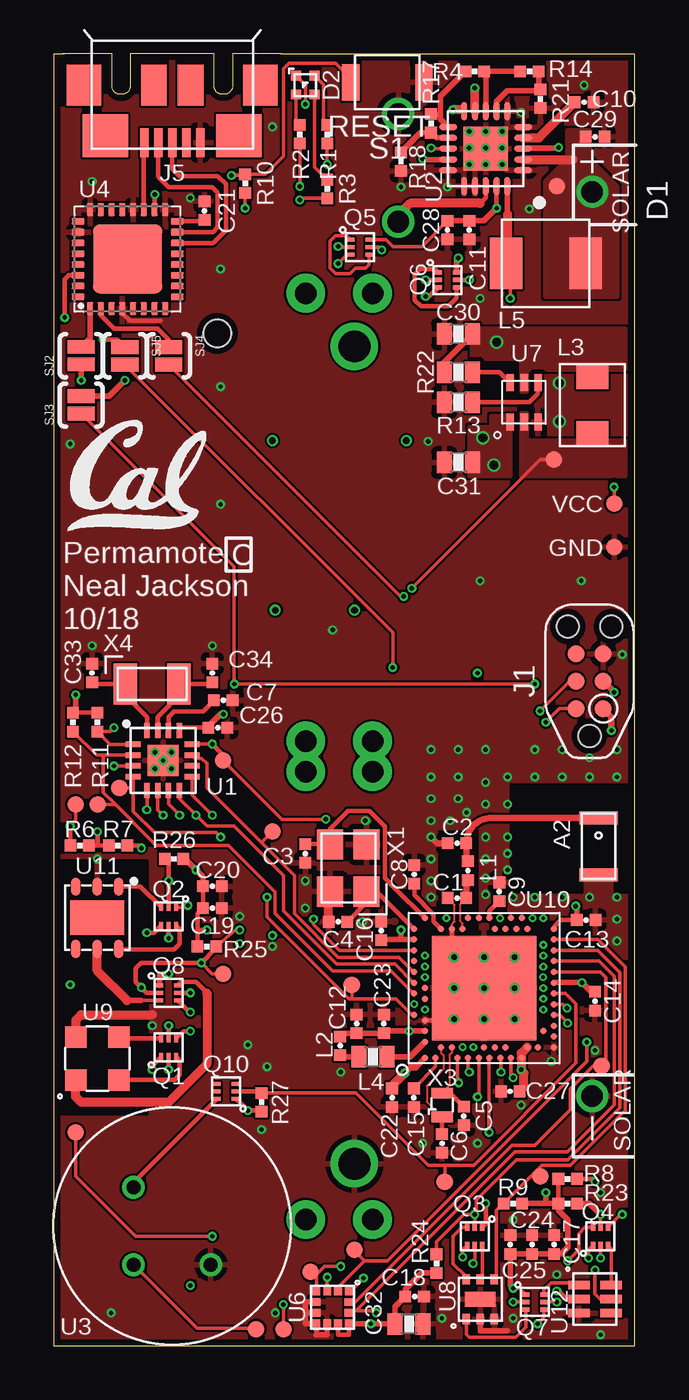
[diagram p4: board, top side]
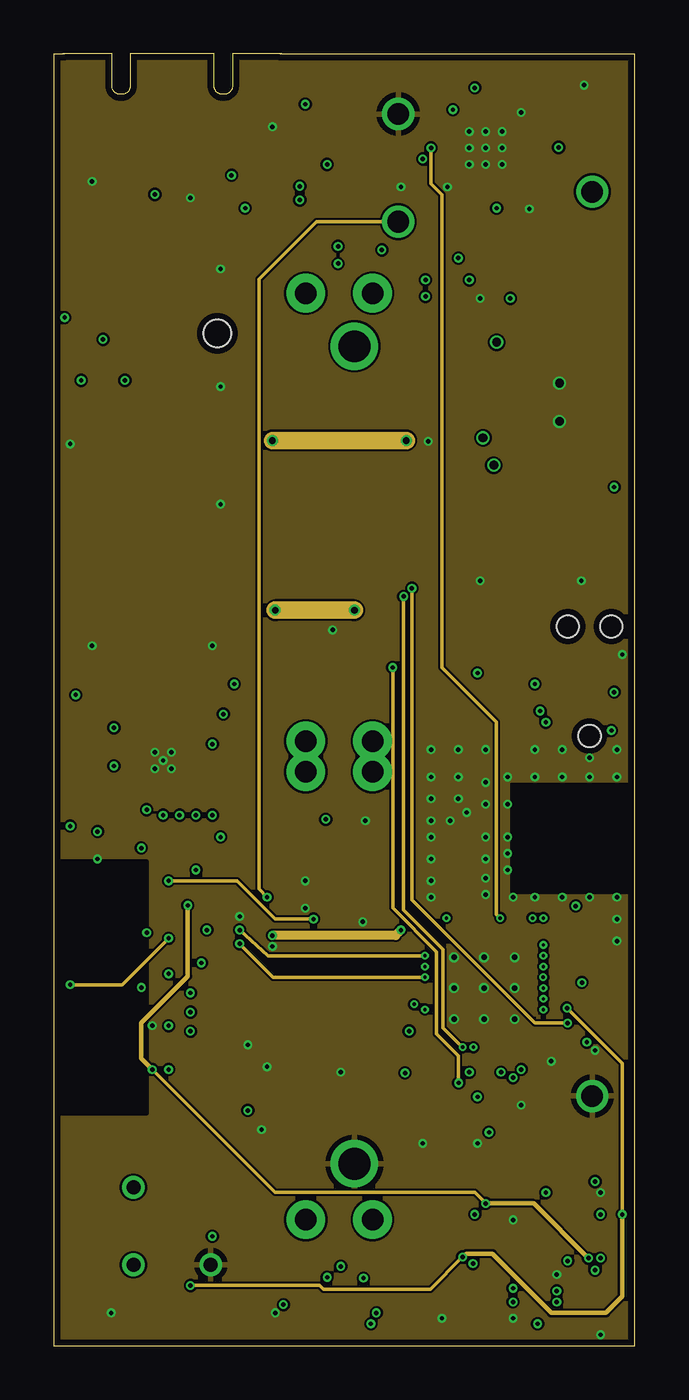
[diagram p5: board, inner layer Route2]
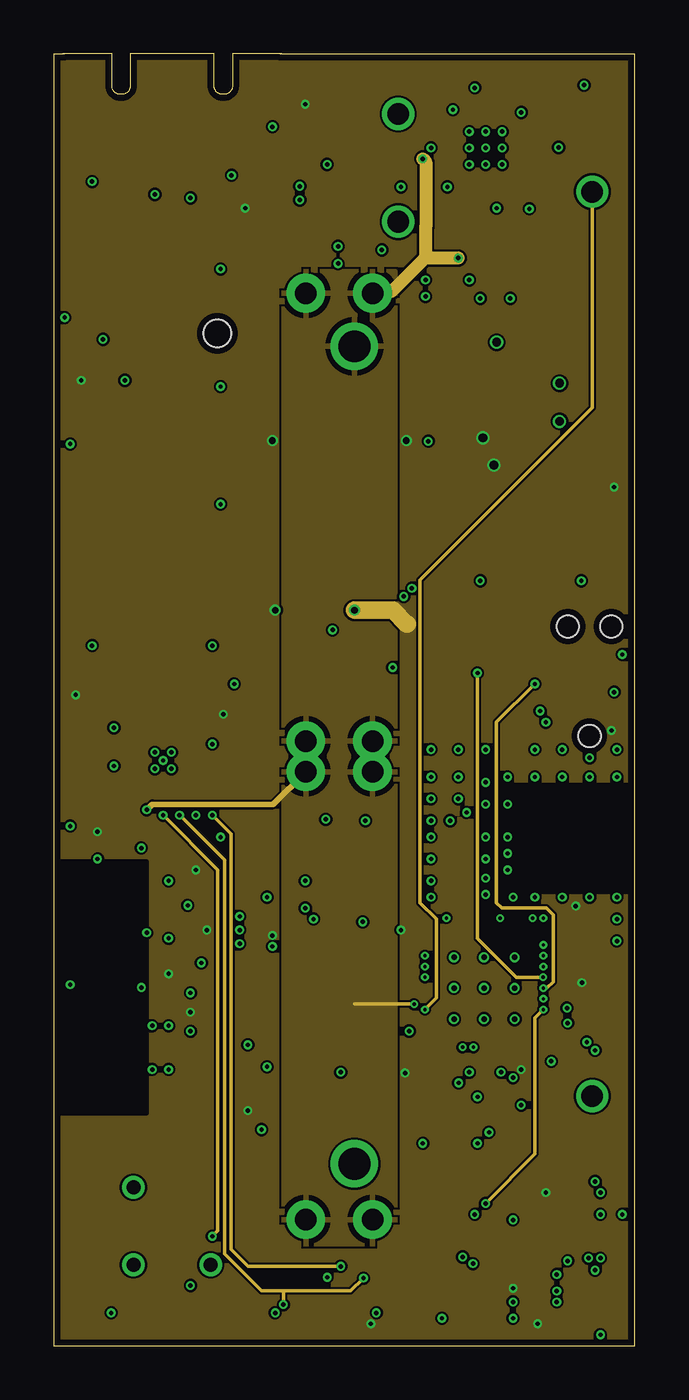
[diagram p6: board, inner layer Route15]
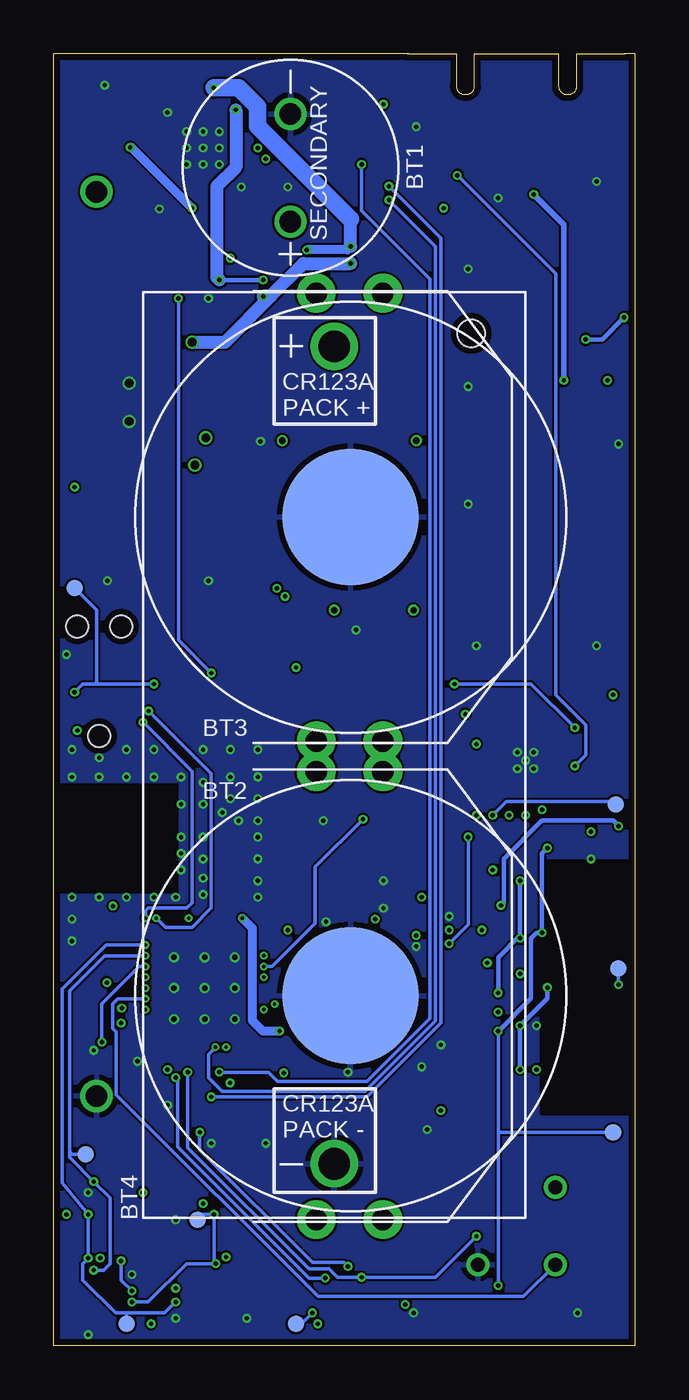
[diagram p7: board, bottom side, seen from below]

Size 27 x 60 mm. Coordinates in mm from the lower left corner, seen from the top.
Outline: 0.5,60 0,60 0,0 27,0 27,60 10.5,60
Copper layers (1+2*15+16): Top 0.0178mm / dielectric 59mil / Route2 0.0356mm / dielectric 0.1499mm / Route15 0.0356mm / dielectric 0.2007mm / Bottom 0.0178mm
Design rules "quickturn_co_kr_1oz_4lyr *": minimum track width 4mil, minimum drill 8mil, track to track 4mil, track to pad 4mil, pad to pad 4mil, via to via 4mil, smd to smd 4mil, copper to edge 12mil, drill to drill 12mil, minimum pad ring 8mil, minimum via ring 4mil, stop-mask expansion 3mil, vias tented up to drill 50mil, thermal gap 10mil
tKeepout: area 13.4,0.8 to 13.5,1.3
tRestrict: area 11.9,1.8 to 12.4,1.8; area 11.9,1.3 to 12.4,1.3; area 12.4,0.8 to 12.5,1.3; area 20.1,1 to 20.2,1.5

### Footprints (pad centres in the part's own frame; a part is rotated, then mirrored left to right if it is on the bottom)
ANT3216A063R2400A = smd 0.6 x 1.8: S1 -1.325,0; S2 1.325,0
1020 = drill 1: + -2.5,0; - 2.5,0
BAT-HLD-002-THM = smd 6.35 x 6.35: GND 0,0 | drill 1 pad 1.8: POS1 -10.4,1.5; POS2 -10.4,-1.6; POS3 10.4,1.5; POS4 10.4,-1.6
BH123A = drill 1.47: + 18.985,0; - -18.985,0 | hole 1.27: 19.58,-6.37
0402_CAP = smd 0.536 x 0.546: 1 -0.433,0; 2 0.433,0
0603_CAP = smd 0.7 x 1: 1 -0.65,0; 2 0.65,0
SOLAR_HOLES = drill 1: + 0,0; - 42,0
1MM_SQ_4PAD = smd 0.457 x 0.457: 1 0.432,0.432; 2 0.432,-0.432; 3 -0.432,-0.432; 4 -0.432,0.432
TC2030-IDC-NL = smd 0.787 x 0.787: 1 -1.27,-0.635; 2 -1.27,0.635; 3 0,-0.635; 4 0,0.635; 5 1.27,-0.635; 6 1.27,0.635 | hole 1.016: -2.54,0; 2.54,1.016; 2.54,-1.016
MICRO_USB_B_HIROSE_ZX62R-B-5P(30) = smd 0.4 x 1.35: 1 1.3,4.125; 2 0.65,4.125; 3 0,4.125; 4 -0.65,4.125; 5 -1.3,4.125 | smd 2.1 x 2: P$1 3.1,3.8; P$2 -3.1,3.8 | smd 1.6 x 1.9: P$3 -4.1,1.45; P$6 4.1,1.45 | smd 1.2 x 1.9: P$4 -0.85,1.45; P$5 0.85,1.45
IHL-1212BZ-11 = smd 1.2 x 1.5: P$1 -1.35,0; P$2 1.35,0
74437324220 = smd 1.5 x 2.4: P$1 1.85,0; P$2 -1.85,0
XDFN-6 = smd 0.35 x 0.2: 1 -0.425,0.35; 2 -0.425,0; 3 -0.425,-0.35; 4 0.425,-0.35; 5 0.425,0; 6 0.425,0.35
0402_RES = smd 0.536 x 0.546: 1 -0.433,0; 2 0.433,0
0603-RES = smd 0.7 x 1: 1 -0.65,0; 2 0.65,0
B3U-1000P = smd 0.8 x 1.7: 1 -1.7,0; 2 1.7,0
SJ_2S-NOTRACE = smd 0.635 x 1.27: 1 -0.401,0; 2 0.413,0
PAD.03X.03 = smd 0.762 x 0.762: P$1 0,0
QFN-16-3MM = smd 0.7 x 0.25: 1 -1.4,0.75; 2 -1.4,0.25; 3 -1.4,-0.25; 4 -1.4,-0.75; 9 1.35,-0.75; 10 1.35,-0.25; 11 1.35,0.25; 12 1.35,0.75 | smd 0.25 x 0.7: 5 -0.75,-1.4; 6 -0.25,-1.4; 7 0.25,-1.4; 8 0.75,-1.4; 13 0.75,1.4; 14 0.25,1.4; 15 -0.25,1.4; 16 -0.75,1.4 | smd 1.45 x 1.45: GND 0,0
S-PVQFN-N20-RGR = smd 0.28 x 0.85: 1 -1,-1.74; 2 -0.5,-1.74; 3 0,-1.74; 4 0.5,-1.74; 5 1,-1.74; 11 1,1.74; 12 0.5,1.74; 13 0,1.74; 14 -0.5,1.74; 15 -1,1.74 | smd 0.85 x 0.28: 6 1.74,-1; 7 1.74,-0.5; 8 1.74,0; 9 1.74,0.5; 10 1.74,1; 16 -1.74,1; 17 -1.74,0.5; 18 -1.74,0; 19 -1.74,-0.5; 20 -1.74,-1 | smd 2.05 x 2.05: PAD 0,0
AMN2 = drill 0.65: GND 1.796,-1.796; OUT -1.796,-1.796; VCC -1.796,1.796
QFN32 = smd 0.6 x 0.3: 1 -2.3,1.75; 2 -2.3,1.25; 3 -2.3,0.75; 4 -2.3,0.25; 5 -2.3,-0.25; 6 -2.3,-0.75; 7 -2.3,-1.25; 8 -2.3,-1.75; 17 2.3,-1.75; 18 2.3,-1.25; 19 2.3,-0.75; 20 2.3,-0.25; 21 2.3,0.25; 22 2.3,0.75; 23 2.3,1.25; 24 2.3,1.75 | smd 0.3 x 0.6: 9 -1.75,-2.3; 10 -1.25,-2.3; 11 -0.75,-2.3; 12 -0.25,-2.3; 13 0.25,-2.3; 14 0.75,-2.3; 15 1.25,-2.3; 16 1.75,-2.3; 25 1.75,2.3; 26 1.25,2.3; 27 0.75,2.3; 28 0.25,2.3; 29 -0.25,2.3; 30 -0.75,2.3; 31 -1.25,2.3; 32 -1.75,2.3 | smd 3.2 x 3.2: EXP 0,0
LGA-12 = smd 0.375 x 0.35: 1 -0.75,0.75; 2 -0.75,0.25; 3 -0.75,-0.25; 4 -0.75,-0.75; 7 0.75,-0.75; 8 0.75,-0.25; 9 0.75,0.25; 10 0.75,0.75 | smd 0.35 x 0.375: 5 -0.25,-0.75; 6 0.25,-0.75; 11 0.25,0.75; 12 -0.25,0.75
UDFN-6-MAXIM = smd 0.8 x 0.35: 1 -0.915,0.65; 2 -0.915,0; 3 -0.915,-0.65; 4 0.915,-0.65; 5 0.915,0; 6 0.915,0.65
UDFN-6-EXPOSED = smd 0.48 x 0.36: 1 -0.925,0.65; 2 -0.925,0; 3 -0.925,-0.65; 4 0.925,-0.65; 5 0.925,0; 6 0.925,0.65 | smd 0.71 x 1.4: EP 0,0
4-SMD = smd 1 x 1: 1 -1,1; 2 -1,-1; 3 1,-1; 4 1,1
AQFN73 = smd 0.3 x 0.3: A8 -1.25,3.25; A10 -0.75,3.25; A12 -0.25,3.25; A14 0.25,3.25; A16 0.75,3.25; A18 1.25,3.25; A20 1.75,3.25; A22 2.25,3.25; A23 2.75,3.25; AA24 3.25,-2.25; AB2 -2.75,-2.5; AC5 -2,-2.75; AC9 -1,-2.75; AC11 -0.5,-2.75; AC13 0,-2.75; AC15 0.5,-2.75; AC17 1,-2.75; AC19 1.5,-2.75; AC21 2,-2.75; AC24 3.25,-2.75; AD2 -2.75,-3.25; AD4 -2.25,-3.25; AD6 -1.75,-3.25; AD8 -1.25,-3.25; AD10 -0.75,-3.25; AD12 -0.25,-3.25; AD14 0.25,-3.25; AD16 0.75,-3.25; AD18 1.25,-3.25; AD20 1.75,-3.25; AD22 2.25,-3.25; AD23 2.75,-3.25; B1 -3.25,2.75; B3 -2.5,2.75; B5 -2,2.75; B7 -1.5,2.75; B9 -1,2.75; B11 -0.5,2.75; B13 0,2.75; B15 0.5,2.75; B17 1,2.75; B19 1.5,2.75; B24 3.25,2.75; C1 -3.25,2.25; D2 -2.75,2; D23 2.75,2; E24 3.25,1.75; F2 -2.75,1.5; F23 2.75,1.5; G1 -3.25,1.25; H2 -2.75,1; H23 2.75,1; J1 -3.25,0.75; J24 3.25,0.75; K2 -2.75,0.5; L1 -3.25,0.25; L24 3.25,0.25; M2 -2.75,0; N1 -3.25,-0.25; N24 3.25,-0.25; P2 -2.75,-0.5; P23 2.75,-0.5; R1 -3.25,-0.75; R24 3.25,-0.75; T2 -2.75,-1; T23 2.75,-1; U1 -3.25,-1.25; U24 3.25,-1.25; V23 2.75,-1.5; W1 -3.25,-1.75; W24 3.25,-1.75; Y2 -2.75,-2; Y23 2.75,-2 | smd 4.85 x 4.85: GND 0,0
DFN-6/3MM = smd 0.85 x 0.45: 1 -1.45,1; 2 -1.45,0; 3 -1.45,-1; 4 1.45,-1; 5 1.45,0; 6 1.45,1 | smd 1.6 x 2.5: P$1 0,0
FN-6 = smd 1 x 0.4: 1 -0.75,0.65; 2 -0.75,0; 3 -0.75,-0.65; 4 0.75,-0.65; 5 0.75,0; 6 0.75,0.65
TXC-7V = smd 1.4 x 1.2: 1 -1.1,-0.85; 2 1.1,-0.85; 3 1.1,0.85; 4 -1.1,0.85
ABS05 = smd 0.5 x 1: A -0.55,0; B 0.55,0
2-SMD = smd 1.092 x 1.905: 1 -1.245,0; 2 1.245,0

### Placement (x,y rotation side)
A2  25.31,23.19 270 top
BT1  16,54.7 90 bottom
BT2  13.21,16.26 270 bottom
BT3  13.21,38.48 270 bottom
BT4  13.97,27.43 90 bottom
C1  18.73,20.79 180 top
C2  18.73,23.33 180 top
C3  11.68,22.86 90 top
C4  13.21,19.68 0 top
C5  19.05,10.67 90 top
C6  18.03,9.4 90 top
C7  7.87,29.97 0 top
C8  16.75,21.89 90 top
C9  20.7,21.08 90 top
C10  24.64,57.75 0 top
C11  19.3,51.82 270 top
C12  14.06,14.95 90 top
C13  24.73,19.77 0 top
C14  25.15,16 270 top
C15  16.73,11.52 270 top
C16  15.21,19.27 90 top
C17  23.24,4.7 90 top
C18  16.76,2.29 0 top
C19  7.37,20.32 0 top
C20  7.37,21.34 0 top
C21  7,52.71 90 top
C22  15.72,11.52 270 top
C23  15.34,14.95 90 top
C24  22.23,4.7 90 top
C25  21.21,4.7 90 top
C26  7.62,28.7 0 top
C27  21.21,11.81 180 top
C28  18.29,51.82 270 top
C29  25.15,56.15 0 top
C30  18.8,46.99 180 top
C31  18.8,41.02 180 top
C32  16.51,1.02 0 top
C33  1.78,31.24 90 top
C34  7.37,31.24 90 top
D1  25.02,53.59 270 top
D2  11.68,58.55 90 top
J1  24.89,30.86 90 top
J5  5.5,60 180 top
L1  19.24,22.06 270 top
L2  13.3,13.93 270 top
L3  25.02,43.69 270 top
L4  14.83,13.42 0 top
L5  22.86,50.26 180 top
Q1  5.33,13.84 90 top
Q2  5.33,19.94 270 top
Q3  19.56,5.08 270 top
Q4  25.4,5.08 90 top
Q5  14.22,51.02 0 top
Q6  18.29,49.5 0 top
Q7  22.35,2.03 0 top
Q8  5.33,16.38 0 top
Q10  8,11.81 180 top
R1  12.7,56.26 270 top
R2  11.43,56.26 270 top
R3  12.7,53.72 270 top
R4  19.56,59.18 0 top
R6  1.21,23.23 0 top
R7  2.98,23.23 180 top
R8  23.88,7.75 180 top
R9  21.34,6.6 0 top
R10  8.89,53.98 270 top
R11  2.03,28.96 90 top
R12  0.89,28.96 90 top
R13  18.8,43.81 0 top
R14  22.1,59.18 180 top
R17  17.53,56.77 90 top
R18  16.13,54.99 90 top
R21  22.61,57.91 90 top
R22  18.8,45.21 180 top
R23  23.88,6.6 180 top
R24  17.78,3.81 270 top
R25  7.11,18.54 180 top
R26  5.59,22.61 0 top
R27  9.65,11.3 270 top
S1  15.49,58.67 180 top
SJ2  1.27,45.97 90 top
SJ3  1.27,43.69 90 top
SJ4  5.33,45.97 270 top
SJ5  3.3,45.97 270 top
TP1  1.02,9.91 0 bottom
TP2  1.02,25.15 0 top
TP3  10.67,0.76 180 top
TP4  1.02,9.91 0 top
TP5  11.94,3.43 0 top
TP6  7.87,27.18 0 top
TP7  13.97,4.45 0 top
TP8  7.87,17.27 0 top
TP9  23.62,1.02 0 bottom
TP10  20.32,5.84 0 bottom
TP11  18.16,7.62 0 top
TP12  0.76,17.53 0 bottom
TP13  10.16,23.88 0 top
TP14  3.05,25.91 0 top
TP15  0.89,25.15 0 bottom
TP16  2.03,25.15 0 top
TP17  26.04,35.18 0 bottom
TP18  25.45,13 0 top
TP19  15.75,1.02 0 bottom
TP20  25.53,8.89 0 bottom
TP21  22.61,7.87 0 top
TP22  9.4,0.76 0 top
TP23  23.37,53.85 0 top
TP24  13.84,16.76 0 top
TP25  23.24,41.15 0 top
TP26  26.04,39.12 0 top
TP27  26.04,37.08 0 top
U1  5.08,27.18 0 top
U2  20.07,55.59 90 top
U3  5.5,5.56 0 top
U4  3.43,50.47 90 top
U6  12.95,1.78 270 top
U7  21.84,43.81 90 top
U8  19.81,2.16 90 top
U9  2.03,13.34 90 top
U10  19.99,16.61 90 top
U11  2.02,19.88 270 top
U12  25.15,2.16 0 top
U$2  [UCB_CAL_200MIL]  0.64,37.85 0 top
X1  13.68,22.19 90 top
X3  18.03,11.18 90 top
X4  4.57,30.73 0 top

### Tracks (layer width: path | path; a pad name or v marks a point on that pad's centre or on a via)
!CLR_EN  (via drill 0.15, 0.2)
  Top 0.152: Q7.2 v21.34,2.03 | v25.4,4.06 Q4.2 | Q4.5 v25.4,6.1
  Top 0.254: R23.1 24.89,6.6 v25.4,6.1
  Bottom 0.152: v21.34,2.03 21.84,1.52 23.62,1.52 | 23.62,1.52 24.13,1.52 25.65,3.05 25.65,3.81 v25.4,4.06 v25.4,6.1 26.62,7.57 26.62,16.56 24.57,18.61 U10.AC21 | TP9.P$1 23.62,1.52
  other vias: 22.74,18.61
!CLR_INT  (via drill 0.15, 0.2)
  Top 0.152: U12.5 25.4,2.16 25.15,2.41 v25.15,3.5
  Top 0.203: v25.15,7.62 25.02,7.75 R8.1
  Bottom 0.152: v25.15,3.5 24.69,3.5 24.38,3.81 24.38,6.86 v25.15,7.62 26.26,8.74 26.26,9.02 | U10.AC19 24.64,18.11 26.26,16.48 26.26,9.02 | TP20.P$1 26.14,8.89 26.26,9.02
  other vias: 22.74,18.11
!FTDI_RESET  (via drill 0.2)
  Top 0.203: U4.18 4.68,53.45 v4.7,53.47
  Top 0.254: SJ3.2 2.57,44.1 v3.3,44.83
  Bottom 0.254: v3.3,44.83 3.3,52.07 v4.7,53.47
!HUM_EN  (via drill 0.2)
  Top 0.152: U10.A20 13.26,18.36 12.06,19.56 v12.06,19.81
  Top 0.203: Q2.5 v5.33,18.92 | Q8.5 v6.35,16.38 | Q2.2 v5.33,21.59 5.33,22.43 R26.1
  Route2 0.152: v12.06,19.81 10.29,19.81 8.51,21.59 v5.33,21.59 | v5.33,18.92 3.17,16.76 v0.76,16.76
  Bottom 0.152: v0.76,16.76 TP12.P$1
  Bottom 0.203: v5.33,21.59 5.33,19.05 | 5.33,19.05 v5.33,18.92 | 5.33,19.05 6.35,18.03 v6.35,16.38
!LT_EN  (via drill 0.2)
  Top 0.152: Q3.5 19.56,3.89 v19.48,3.81 | Q7.5 v23.37,2.03 | Q3.2 v19.56,6.1 | R24.1 17.78,4.83 19.05,6.1 v19.56,6.1 | U10.AD20 25.27,18.36 26.29,17.34 26.29,11.05 23.88,8.64 21.49,8.64 19.63,6.78 19.63,6.17 v19.56,6.1
  Bottom 0.152: v19.48,3.81 19.56,3.81 | 19.56,3.81 v19.56,6.1 20.07,6.1 TP10.P$1 | v23.37,2.03 22.61,2.03 20.83,3.81 19.56,3.81
!LT_INT
  Top 0.152: U10.AD22 25.29,18.86 26.54,17.6 26.54,10.92 24,8.38 22.68,8.38 22.17,7.87 | 22.17,7.87 R9.1 20.57,6.28 20.57,3.2 U8.4 | 22.17,7.87 TP21.P$1
!PIR_EN
  Top 0.152: U10.AD12 23.77,16.36 24.26,15.88 24.26,13.13 19.51,8.38 18.16,8.38 | R27.1 14.04,11.74 17.4,8.38 18.16,8.38 | TP11.P$1 18.16,8.38
  Top 0.203: Q10.2 9.58,11.81 R27.1
!PR_EN  (via drill 0.15 pad 0.3, 0.2)
  Top 0.152: v6.86,17.78 7.37,17.27 TP8.P$1 | R25.1 8.43,19.3 v8.64,19.3
  Top 0.203: Q1.5 v5.33,14.86 | Q1.2 v5.33,12.83 | Q8.2 4.32,16.38 v4.06,16.64 3.81,16.89 3.81,17.53 4.06,17.78 v6.86,17.78 7.54,18.47 R25.1
  Route2 0.152: U10.B19 9.96,18.11 v8.64,19.3
  Bottom 0.203: v5.33,12.83 v5.33,14.86 4.06,16.13 v4.06,16.64
  other vias: 17.24,18.11
!RST  (via drill 0.15, 0.2)
  Top 0.152: U1.1 2.63,27.93 R11.1 2.62,28.52 v2.79,28.7 | v22.35,30.73 v8.38,30.73 8.38,36.17 SJ3.1
  Top 0.305: J1.3 v26.04,30.35
  Route15 0.152: v22.35,30.73 20.57,28.96 20.57,20.57 20.83,20.32 22.88,20.32 23.2,20 23.2,16.9 22.91,16.61 U10.AC13
  Bottom 0.152: v2.79,28.7 4.83,30.73 v8.38,30.73 | TP17.P$1 25.02,34.16 25.02,30.73 | v22.35,30.73 25.02,30.73 | 25.02,30.73 25.65,30.73 v26.04,30.35
  other vias: 22.74,16.61
!RTC_EXTR  (via drill 0.2)
  Top 0.152: U1.3 v2.8,26.93 v2.79,26.92 | v8.26,54.36 8.84,54.36 R10.1 9.83,54.41 10.67,55.24 10.67,59.31 10.92,59.56 13.08,59.56 13.79,58.85 S1.2
  Bottom 0.152: v2.79,26.92 2.29,27.43 2.29,28.83 3.68,30.23 3.68,49.78 v8.26,54.36
!RTC_IRQ1
  Top 0.152: U1.11 6.58,27.28 6.88,27.28 7.11,27.04 7.11,25.91 9.65,23.37 | 9.65,23.37 11.18,21.84 11.18,20.07 13.21,18.03 16.04,18.03 16.71,17.36 U10.A16 | TP13.P$1 9.65,23.37
!RTC_IRQ2  (via drill 0.15, 0.2)
  Top 0.152: U1.4 3.68,25.91 | 3.68,25.91 3.68,24.82 4.67,23.82 7.54,23.82 v7.75,23.62 | TP14.P$1 3.68,25.91
  Route2 0.152: U10.B15 10.2,17.11 v8.64,18.67
  Bottom 0.152: v7.75,23.62 7.75,19.56 v8.64,18.67
  other vias: 17.24,17.11
!RTC_IRQ3  (via drill 0.2)
  Top 0.152: U1.8 5.83,25.41 v6.6,24.64 7.11,24.13 8.38,24.13 10.67,21.84 10.67,20.19 13.13,17.73 15.84,17.73 16.71,16.86 U10.A14
  Bottom 0.152: v6.6,24.64 5.97,25.27 1.02,25.27 TP15.P$1
!VBAT_PRI_ON  (via drill 0.2)
  Top 0.203: Q6.2 v17.27,49.5 | Q6.5 v19.3,49.5 | U2.10 19,57.4
  Top 0.406: 19,57.4 v18.54,57.4
  Bottom 0.203: v17.27,49.5 v19.3,49.5
  Bottom 0.61: v19.3,49.5 19.43,49.62 19.43,53.85 18.54,54.74 v18.54,57.4
!VBAT_SEC_ON  (via drill 0.2)
  Top 0.152: Q5.2 13.24,51.02 v13.21,51.05 | Q5.5 15.11,51.02 v15.24,50.9
  Top 0.406: U2.9 v19.57,58.41 v19.56,58.42
  Bottom 0.406: v13.21,51.05 13.37,50.9 v15.24,50.9
  Bottom 0.61: v13.21,51.05 13.21,52.32
  Bottom 0.813: v19.56,58.42 18.41,58.42 17.53,57.54 17.53,56.64 13.21,52.32
ACC_CS  (via drill 0.15, 0.2)
  Top 0.152: U6.2 13.3,2.62 13.3,2.81 14.43,3.94 | 14.43,3.94 15.49,3.94 24.77,13.21 v24.77,14.1 | TP7.P$1 13.97,4.39 14.43,3.94
  Bottom 0.152: U10.AC17 23.03,17.61 24.77,15.88 v24.77,14.1
  other vias: 22.74,17.61
ACC_INT1
  Top 0.152: U6.12 14.02,2.03 21.29,9.3 22.35,9.3 24,10.95 24,11.94 25.07,13 TP18.P$1 25.65,13 25.65,17.09 25.39,17.36 U10.AD16
ACC_INT2  (via drill 0.2)
  Top 0.152: U6.11 13.8,1.62 14.04,1.62 | 14.04,1.62 21.41,8.99 23.85,8.99 26.04,11.18 26.04,17.14 25.32,17.86 U10.AD18 | 14.04,1.62 14.89,1.62 v14.99,1.52
  Bottom 0.152: v14.99,1.52 15.49,1.02 TP19.P$1
D+
  Top 0.203: J5.3 5.5,54.67 5.84,54.32 7.62,54.32 8,53.94 8,51.82 7.4,51.22 U4.14
D-
  Top 0.203: J5.2 4.85,54.3 5.33,53.82 7.37,53.82 7.62,53.56 7.62,51.94 7.39,51.72 U4.15
DBG_RX  (via drill 0.2)
  Top 0.152: U10.G1 18.74,12.27 v18.81,12.2 | SJ5.2 15.75,33.12 v15.75,31.5
  Route2 0.152: v18.81,12.2 18.81,13.45 17.78,14.48 17.78,18.29 15.75,20.32 v15.75,31.5
DBG_TX  (via drill 0.15, 0.2)
  Top 0.152: SJ4.2 16.1,34.8 v16.26,34.8
  Route2 0.152: U10.H2 18.09,14.77 18.09,18.41 16.26,20.24 v16.26,34.8
  other vias: 18.99,13.86
FTDI_VCCIO
  Top 0.254: U4.1 1.68,46.8 SJ2.2
GND  (via drill 0.2, 0.25, 0.41)
  Top 0.102: U10.F23 18.49,19.57 18.62,19.7 18.62,20.47 C1.2
  Top 0.203: U10.B7 18.49,15.11 U10.GND | U10.F23 18.49,18.54 | 18.49,18.54 18.49,18.14 v18.59,18.03 | U10.GND 19.99,17.04 18.49,18.54 | U10.GND 19.99,17.18 18.53,18.64 | U4.4 3.18,47.96 3.54,47.6 4.97,47.6
  Top 0.254: U6.8 12.7,0.51 12.19,0.51 12.2,0.52 U6.7 12.19,1.02 11.68,1.02 11.68,1.52 | 11.68,1.52 11.69,1.53 U6.6 | 11.68,1.52 11.68,2.03 U6.5 | U8.2 19.81,0.69 21.08,0.69
  Top 0.305: v17.53,23.62 17.82,23.33 C2.2
  Top 0.406: U9.4 1.03,15.13 1.27,15.37 4.57,15.37 | C4.1 12.78,21.03 X1.4
  other vias: 18.29,53.82 6.35,53.31 7.75,50.01 10.16,56.61 4.57,14.86 23.5,44.7 23.5,42.93 19.3,56.39 20.07,56.39 20.83,56.39 20.83,55.63 20.07,55.63 19.3,55.63 19.3,54.86 20.07,54.86 20.83,54.86 1.78,54.07 22.1,52.8 19.99,18.03 19.99,16.61 19.99,15.16 18.59,16.61 21.41,16.61 21.41,15.16 21.41,18.03 18.59,15.16 14.48,24.38 5.08,27.18 23.11,13.21 4.7,27.56 5.46,27.56 5.46,26.8 4.7,26.8 19.81,48.64 8.64,19.94 21.34,1.27 21.34,5.84 17.53,20.83 17.53,21.59 17.53,22.61 17.53,24.38 21.08,22.86 20.07,21.72 20.07,20.95 22.35,20.83 23.62,20.83 24.89,20.83 26.16,20.83 21.08,23.62 21.08,25.15 21.08,26.42 18.41,24.38 22.35,26.42 23.62,26.42 24.89,26.42 26.16,26.42 25.15,13.72 19.18,24.77 20.07,25.15 2.03,22.61 18.03,1.27 25.4,7.11 23.37,3.3 25.4,0.51 20.07,23.62 20.07,22.61 20.07,26.16 18.8,26.42 17.53,26.42 17.53,25.4 18.8,25.4 26.16,19.81 26.16,18.8 17.53,27.69 18.8,27.69 20.07,27.69 22.35,27.69 23.62,27.69 24.89,27.3 26.16,27.69 10.29,1.52 2.67,1.52 21.72,11.18 17.14,9.4 19.68,9.4 21.72,57.28 24.64,58.55 11.68,21.59 11.68,20.32 14.35,19.68 7.37,32.51 1.78,32.51 13.34,12.7 9.91,12.95 10.16,18.54 9.02,13.97 9.65,10.03 16.13,53.82 7.75,44.55 0.76,41.88 12.95,33.24 7.75,39.08 17.4,42.01 19.81,35.53 24.51,35.53 26.42,32.1 21.34,20.83 21.08,22.1
  pour Top (rank 2): 0,60 27,60 27,0 0,0
  pour Bottom (rank 2): 0,60 27,60 27,0 0,0
  pour Top (rank 2, no thermals): 24.55,22.05 26.07,22.05 26.07,20.76 24.55,20.76
  pour Route2 (rank 2): 0,60 0,0 27,0 27,60
LBST  (via drill 0.15, 0.2)
  Top 0.152: L5.P$1 20.9,50.15 21.21,49.84 v21.21,48.64 | U10.AC15
  Top 0.254: U2.20 21.07,52.05 21.08,52.55
  Top 0.406: 21.08,52.55 21.08,50.33 L5.P$1
  Route15 0.152: U10.AC15 21.5,17.11 19.68,18.92 v19.68,31.24
  Bottom 0.152: v21.21,48.64 21.21,32.77 v19.68,31.24
  other vias: 22.74,17.11
LED_BLUE  (via drill 0.15, 0.2)
  Top 0.152: R3.2 11.51,53.29 v11.43,53.21
  Bottom 0.152: U10.K2 19.81,13.54 19.81,12.45 19.18,11.81 12.55,11.81 9.27,15.09 9.27,51.05 v11.43,53.21
  other vias: 19.49,13.86
LED_GREEN  (via drill 0.2)
  Top 0.152: U10.L1 19.74,11.61 v19.68,11.56 | R2.2 v11.43,53.85
  Bottom 0.152: v19.68,11.56 12.45,11.56 9.02,14.99 9.02,51.44 v11.43,53.85
LED_RED  (via drill 0.2)
  Top 0.152: U10.J1 19.24,12.76 v19.3,12.7 | R1.2 v12.7,54.86
  Bottom 0.152: v19.3,12.7 17.02,12.7 16.6,12.28 12.44,12.28 9.53,15.2 9.53,49.53 12.7,52.7 v12.7,54.86
MISO  (via drill 0.2)
  Top 0.152: U6.3 v12.7,3.17 | v20.78,12.7 20.78,13.32 U10.R1 | U1.6 4.83,24.89 v5.08,24.64 | v7.37,5.08 3.81,5.08 1.02,7.87 TP4.P$1
  Route15 0.152: v5.08,24.64 7.62,22.1 7.62,5.33 v7.37,5.08
  Bottom 0.152: v20.78,12.7 20.78,9.19 15.15,3.57 14.21,3.57 13.81,3.17 v12.7,3.17 9.27,3.17 v7.37,5.08
MOSI  (via drill 0.2)
  Top 0.152: v20.22,9.91 20.22,13.34 U10.N1 | v13.34,3.68 12.57,3.68 12.32,3.43 | U1.9 6.43,25.57 v7.37,24.64 | 12.32,3.43 12.2,3.31 U6.4 | TP5.P$1 12.32,3.43
  Route15 0.152: v13.34,3.68 9.02,3.68 8.23,4.47 8.23,23.77 v7.37,24.64
  Bottom 0.152: v13.34,3.68 13.53,3.87 14.99,3.87 20.22,9.11 v20.22,9.91
N$1
  Top 0.203: U10.N24 20.24,20.19 C9.1
N$2
  Top 0.152: C15.1 17.74,12.96 U10.C1
N$3  (via drill 0.15, 0.2)
  Top 0.254: L2.1 13.45,14.51 C12.1 C23.1 15.43,14.61 v16.51,14.61 U10.B5
  Bottom 0.406: U10.E24 17.78,19.4 17.78,15.11 17.27,14.61 v16.51,14.61
  other vias: 18.24,19.86
N$4
  Top 0.152: 16.75,21.43 C8.1
  Top 0.203: U10.D23 17.65,19.71 17.65,20.03 16.75,20.93 16.75,21.43
N$5
  Top 0.102: U10.H23 18.99,19.61 18.89,19.71 18.89,20.52 C1.1
  Top 0.305: C1.1 19.16,21.55 arc-90 L1.2
N$6
  Top 0.305: L1.1 arc-90 19.16,22.57 C2.1 arc-90 20.35,24.52 A2.S1
N$7
  cutout Route2: 21.24,21.02 26.96,21.02 26.96,26.1 21.24,26.1
N$8
  Top 0.203: C3.2 X1.3 12.83,24.01 13.66,24.84 14.67,24.84 15.39,24.12 15.39,21.71 15.88,21.22 U10.B24
N$9
  Top 0.203: U10.A23 15.05,21.06 15.05,21.09 X1.1 14.53,20.58 C4.2
N$10
  cutout Top: 0,22.48 1.78,22.48 1.78,20.95 2.29,20.95 2.29,22.48 4.32,22.48 4.32,10.79 0,10.79
  cutout Route2: 0,22.48 1.78,22.48 2.29,22.48 4.32,22.48 4.32,10.79 0,10.79
  cutout Route15: 0,22.48 1.78,22.48 2.29,22.48 4.32,22.48 4.32,10.79 0,10.79
  cutout Bottom: 0,22.48 1.78,22.48 2.29,22.48 4.32,22.48 4.32,10.79 0,10.79
N$11
  cutout Top: 19.68,19.3 17.91,19.3 17.91,23.88 19.68,23.88
N$12
  Top 0.203: R13.2 22.1,43.81 22.49,44.21 U7.4
N$13
  Top 0.203: U4.16 6.94,52.22 C21.1
N$14
  Top 0.203: U7.6 20.71,45.21 R22.1
N$15
  Top 0.152: D2.2 12.52,58.57 12.52,56.87 R1.1
N$17
  Top 0.152: R2.1 11.25,56.87 D2.4
N$18
  Top 0.254: U2.7 20.57,57.78 21.08,58.29 22.55,58.29 R21.2 22.53,58.42 R14.1
N$19
  Top 0.152: D2.3 12.12,54.74 R3.1
N$20
  Top 0.152: U8.1 19.16,0.52 19.3,0.38 21.46,0.38 21.93,0.84 Q7.3
N$21
  Top 0.203: Q8.6 5.92,16.89 6.6,16.89 7.11,16.38
  Top 0.406: 7.11,16.38 7.11,13.08 5.33,11.3 1.27,11.3 1.02,11.56 1.02,12.32 U9.1
N$22
  Top 0.152: 4.06,16.03 Q8.3
  Top 0.254: 3.4,16.03 4.06,16.03
  Top 0.406: 3.4,16.03 2.02,17.41 U11.5
N$23
  Top 0.203: Q10.6 3.7,7.58 U3.VCC
N$25
  Top 0.203: U1.14 5.33,29.21 5.59,29.46 6.93,29.46 C7.1
N$26
  Top 0.203: U1.16 4.33,29.2 3.33,30.2 X4.1 1.85,30.73 C33.1
N$27
  Top 0.203: U1.15 4.83,29.21 5.59,29.97 5.84,29.97 5.82,30 X4.2 7.29,30.73 C34.1
N$31
  Top 0.152: Q7.6 22.78,2.58 23.11,2.92 24.28,2.92 U12.1
N$32
  Top 0.254: R4.2 20.07,59.18 | 20.07,59.18 R14.2 | U2.8 20.07,59.18
N$34
  Top 0.152: Q1.6
  Top 0.203: U9.3 3.1,14.27 Q1.6
N$35
  cutout Route15: 21.24,21.02 26.96,21.02 26.96,26.1 21.24,26.1
N$38
  cutout Top: 21.24,26.1 26.96,26.1 26.96,23.32 26.96,21.02 26.07,21.02 26.07,22.05 24.55,22.05 24.55,21.02 21.24,21.02
N$39
  cutout Bottom: 21.24,21.02 26.96,21.02 26.96,26.1 21.24,26.1
N$41
  Top 0.203: U9.2 5.6,12.34 5.84,12.57 5.84,13.26 Q1.3
N$44
  Top 0.254: L4.2 16.57,13.42 16.57,13.44 U10.B3
N$45
  Top 0.152: Q5.1 13.61,51.56 13.08,51.56 12.83,51.31 12.83,50.04 13.08,49.78 13.76,49.78 14.02,50.04 14.48,50.04 14.65,50.21 Q5.4
N$48
  Top 0.152: Q2.3
  Top 0.203: U11.1 4.02,21.32 Q2.3
N$49
  Top 0.254: L4.1 13.38,13.42 L2.2
N$50
  Top 0.152: Q2.6
  Top 0.203: U11.6 3.03,18.41 5.59,18.41 5.84,18.67 5.84,19.36 Q2.6
N$51
  Top 0.152: U8.6 19.14,3.21 18.54,3.81 18.54,5.08 18.97,5.5 Q3.3
N$52
  Top 0.152: Q3.6 19.91,3.31 U8.5
N$53
  Top 0.152: Q6.4
  Top 0.203: Q6.1 17.7,50.01 17.02,50.01 16.76,49.75 16.76,48.57 17.06,48.27 18.33,48.27 18.71,48.65 Q6.4
N$54
  Top 0.152: Q4.3 25.9,4.5 U12.6
N$55  (via drill 0.2)
  Top 0.152: v23.37,2.54 23.5,2.54 23.88,2.16 U12.2 | Q4.6 24.68,5.5 24.38,5.21 24.38,4.45 v23.88,3.94
  Bottom 0.152: v23.88,3.94 23.88,3.05 v23.37,2.54
N$57
  Top 0.254: U2.12 17.77,56.09 R17.1 17.04,56.34 R18.2
N$58
  Top 0.254: R4.1 17.96,58.02 17.96,57.15 | 17.96,57.15 17.96,56.95 U2.11 | R17.2 17.91,57.2 17.96,57.15
PIR_OUT  (via drill 0.15)
  Top 0.152: U3.OUT 6.65,0.81 9.35,0.81 TP22.P$1
  Bottom 0.152: U3.OUT 5.18,2.29 14.73,2.29 24.09,11.64 24.09,14.57 24.26,14.73 24.26,15.88 24.02,16.11 U10.AC11
  other vias: 22.74,16.11
RTC_CS  (via drill 0.15, 0.2)
  Top 0.152: U1.12 6.44,27.94 v7.37,27.94 | 7.87,27.43 TP6.P$1 10.6,24.45 v12.64,24.45
  Top 0.203: v7.37,27.94 7.87,27.43
  Bottom 0.152: U10.B17 16.86,17.61 14.86,19.61 14.86,22.23 v12.64,24.45
  other vias: 17.24,17.61
RXD
  Top 0.203: SJ4.1 5.33,46.74 4.83,47.24 2.79,47.24 2.18,47.86 U4.2
SCK  (via drill 0.2)
  Top 0.152: U6.1 13.78,2.53 v14.39,3.14 | U1.7 5.33,25.15 v5.84,24.64 | TP3.P$1 v10.67,1.91 | U10.U1 21.24,12.54 v21.34,12.45
  Route15 0.152: v5.84,24.64 7.92,22.55 7.92,4.27 9.65,2.54 10.67,2.54 | 10.67,2.54 13.79,2.54 v14.39,3.14 | v10.67,1.91 10.67,2.54
  Bottom 0.152: v14.39,3.14 15.15,3.14 21.25,9.23 21.25,12.36 v21.34,12.45
SCL  (via drill 0.15, 0.2)
  Top 0.152: Q4.1 24.84,4.45 v24.84,4.06 | Q2.1 6.14,20.36 v6.22,20.45 | TP2.P$1 1.02,24.38 v0.76,24.13
  Top 0.203: Q1.1 4.57,13.01 v4.57,12.83 | v0.76,24.13 0.76,23.24 R6.1 | Q3.1 20.07,5.66 v20.07,6.6
  Route2 0.152: v20.07,6.6 19.56,7.11 10.29,7.11 v4.57,12.83
  Route2 0.203: v4.57,12.83 4.06,13.34 4.06,14.99 4.12,15.04 4.12,15.05 6.22,17.16 v6.22,20.45 | v24.84,4.06 22.3,6.6 v20.07,6.6
  Route15 0.152: U10.AC9 22.36,15.23 22.36,8.9 v20.07,6.6
  Bottom 0.203: v0.76,24.13 1.02,24.38 4.32,24.38 6.1,22.61 6.1,20.57 v6.22,20.45
  other vias: 22.74,15.61
SDA  (via drill 0.2)
  Top 0.152: Q3.4 19,4.44 v19,4.12 | Q4.4 26.34,6.1 v26.42,6.1 | v23.84,15.68 23.66,15.86 U10.AD10
  Top 0.203: Q2.4 4.65,19.18 v4.32,19.18 | Q1.4 6.02,14.61 v6.35,14.61 | R7.1 3.95,23.23 v4.06,23.11
  Route2 0.152: v6.35,2.79 12.34,2.79 12.52,2.62 17.49,2.62 v19,4.12 | v23.84,15.68 26.42,13.11 v26.42,6.1
  Route2 0.203: v19,4.12 19.01,4.12 19.16,4.27 20.38,4.27 21.79,2.86 21.79,2.85 23.11,1.52 25.65,1.52 26.42,2.29 v26.42,6.1
  Bottom 0.152: v6.35,14.61 6.35,9.91 | 6.35,9.91 v6.35,2.79 | TP1.P$1 6.35,9.91
  Bottom 0.203: v6.35,14.61 4.83,16.13 4.83,18.92 4.57,19.18 v4.32,19.18 4.32,22.86 v4.06,23.11
SW  (via drill 0.2)
  Top 0.152: U10.AD8 23.5,15.36 v23.88,14.99 | v16.64,35.18 22.61,41.15 TP25.P$1
  Route2 0.152: v23.88,14.99 22.35,14.99 16.64,20.7 v16.64,35.18
  pour Top (isolate 0.203, no thermals): 21.72,43.31 21.72,40.39 26.54,40.39 26.54,42.04 21.97,42.04 21.97,43.31
SWDCLK  (via drill 0.15, 0.2)
  Top 0.152: v22.59,29.48 23.98,30.86 J1.4
  Bottom 0.152: U10.AA24 21.81,19.43 20.57,19.43 19.68,20.32 19.68,26.57 v22.59,29.48
  other vias: 22.24,19.86
SWDIO  (via drill 0.15, 0.2)
  Top 0.152: v22.86,28.96 23.5,29.59 J1.2
  Bottom 0.152: U10.AC24 22.74,20.18 22.61,20.32 20.83,20.32 20.57,20.57 20.57,26.67 v22.86,28.96
  other vias: 22.74,19.86
TXD  (via drill 0.2)
  Top 0.203: U4.30 0.69,49.72 0.51,49.53 v0.51,47.75 | v2.29,46.74 2.94,46.74 SJ5.1
  Bottom 0.203: v0.51,47.75 1.52,46.74 v2.29,46.74
USB_5V
  Top 0.203: J5.1 4.31,55.77 4.18,55.64 U4.19
VBAT  (via drill 0.15, 0.2)
  Top 0.152: U1.5 4.33,24.9 v4.32,24.89 | Q6.6 18.71,49.88
  Top 0.203: U10.A10
  Top 0.254: v18.8,50.51 18.71,50.43 18.71,49.88 | U2.14 17.17,55.09 v17.14,55.12
  Route15 0.152: U10.A10 16.73,15.88 13.97,15.88
  Route15 0.254: v4.32,24.89 4.57,25.15 10.2,25.15 BT2.POS1
  Route15 0.61: v18.8,50.51 17.27,50.51 | 17.27,50.51 17.24,50.51 15.68,48.96 14.89,48.96 BT3.POS2 | 17.27,50.51 17.27,51.97 17.29,51.98 17.29,54.98 v17.14,55.12
  other vias: 16.74,15.86
  pour Route15: 10.67,49.91 15.88,49.91 15.88,4.7 10.67,4.7
VBAT_OK  (via drill 0.15, 0.2)
  Top 0.152: v17.53,55.63 17.56,55.59 U2.13 | U10.R24
  Route2 0.152: U10.R24 20.57,20.03 20.57,28.96 18.03,31.5 18.03,53.47 17.53,53.98 v17.53,55.63
  other vias: 20.74,19.86
VCC  (via drill 0.2, 0.3, 0.41)
  Top 0.152: Q7.4 22.78,1.31 v22.48,1.02 | Q7.1 21.64,2.67 v21.34,2.67 | TP26.P$1 v26.04,39.88 | 11.2,58.93 D2.1 11.68,58.55 v11.68,57.66 | v8.89,52.83 R10.2
  Top 0.203: C13.1 23.56,19.78 23.28,19.5 23.28,19.4 U10.AD23 | 15.22,18.85 C16.1 | R11.2 2,29.4 R12.2 | C20.1 C19.1 6.68,20.07 6.68,19.3 | R25.2 6.68,19.3 | R6.2 2.03,23.23 | 2.03,23.23 R7.2 | 2.03,23.23 v2.03,23.88 | 6.68,19.3 v7.11,19.3 | R23.2 R8.2 | 15.85,1.03 C32.1 | U6.9 13.21,0.51 13.72,0.51 13.7,0.52 U6.10 | Q8.4 6.3,15.49 v6.35,15.49 | U1.13 5.95,28.7 7.11,28.7 C26.1 | Q10.1 8.48,11.46 v9.02,10.92 9.6,10.92 R27.2 | U10.W1 21.72,13.34
  Top 0.254: 16.82,12.92 16.82,12.94 U10.B1 | v21.34,2.67 21.21,2.79 C25.1 C24.1 C17.1 23.57,4.27 23.88,4.57 23.88,5.84 23.44,6.28 R23.2 22.86,6.6 | R9.2 22.86,6.6 | U6.10 v14.72,1.03 | v14.72,1.03 14.74,1.03 | 14.74,1.03 15.85,1.03 | C32.1 15.86,1.81 C18.1 16.33,2.62 17.09,3.38 R24.2 | 14.74,1.03 v14.73,1.02 v14.72,1.03 | v22.86,7.11 22.86,6.6 | U10.A22 16.13,18.86 | 16.13,18.86 15.24,18.86 15.22,18.85 | R26.2 6.1,22.61 v6.6,22.1 6.93,21.77 C20.1 | v16.13,19.3 16.13,18.86 | 7.11,28.7 7.12,28.7 7.75,29.33 v7.87,29.33 | R12.2 1.02,29.52 v1.02,30.23 | U10.AD14 v24.54,16.87 24.97,16.43 C14.1 | C13.1 24.3,20.37 v24.25,20.42 | Q8.1 4.91,17.19 4.99,17.27 v5.33,17.27 | v1.27,44.83 SJ2.1
  Top 0.305: 16.82,12.92 16.57,12.92 v16.32,12.66 | v25.91,28.57 25.91,29.21 J1.1
  Top 0.406: C22.1 15.72,12.06 v16.32,12.66 | U10.Y2 21.72,13.59 21.72,13.34 v21.72,12.83 21.72,12.78 21.84,12.66 21.84,12.01 C27.1
  Route2 0.406: v16.13,19.3 15.88,19.05 v10.16,19.05
  Route2 0.813: v16.38,42.04 v10.16,42.04 | v13.97,34.16 v10.29,34.16
  Route15 0.813: v13.97,34.16 15.75,34.16 16.38,33.53 16.43,33.53
  other vias: 19.94,42.16 20.45,40.89
  pour Top (isolate 0.203, no thermals): 20.32,43.18 21.21,43.18 21.21,40.39 19.3,40.39 19.3,42.67 20.32,42.67
  pour Route15 (rank 2): 0,60 27,60 27,0 0,0
VOC_SAMP_VSTOR  (via drill 0.2)
  Top 0.152: C11.1 19.99,52.25 | Q5.6 15.43,51.37 15.75,51.05 17.09,51.05 C28.1
  Top 0.203: v20.57,52.83 20.57,53.06 U2.19
  Top 0.254: U2.3 21.82,55.61 23.31,55.61 23.35,55.65 v23.45,55.65 | C28.1 19.99,52.25 v20.57,52.83
  Bottom 0.406: v20.57,52.83 23.39,55.65 v23.45,55.65
VREF_SAMP
  Top 0.406: U2.4 22.55,56.09 C10.1
VSEC  (via drill 0.2)
  Top 0.152: U10.A8 16.64,15.36 15.9,16.11 13.84,16.11 | TP24.P$1 13.84,16.11 | 13.84,16.11 13.72,16.11 9.91,19.91 v9.91,20.83
  Top 0.203: U2.18 20.07,53.31 19.81,53.05
  Top 0.406: 19.81,53.05 16.55,53.05 16,52.51 BT1.+
  Route2 0.152: v9.91,20.83 9.53,21.21 9.53,49.53 12.2,52.2 BT1.+
VSOL  (via drill 0.15)
  Top 0.406: U2.2 24.12,55.09
  Route15 0.152: U10.B9 17.78,16.15 17.78,19.81 17.02,20.57 17.02,35.56 25.02,43.56 D1.+
  other vias: 17.24,15.61
  pour Top (no thermals): 23.88,56.43 23.88,55.09 22.86,54.07 22.86,48.74 26.16,48.74 26.16,53.82 24.89,55.09 24.89,56.43
VSW  (via drill 0.2, 0.41)
  Top 0.152: v13.21,50.26 13.62,50.67 Q5.3
  Top 0.203: Q6.3 17.45,48.74 v17.27,48.74
  Top 0.305: R22.2 18.15,45.69 C30.1
  Bottom 0.61: 16.92,48.74 v17.27,48.74 | v20.57,46.61 19.05,46.61 16.92,48.74 | 16.92,48.74 15.4,50.26 v13.21,50.26
  pour Top (isolate 0.203, no thermals): 21.72,44.32 21.72,45.85 19.43,45.85 19.43,47.24 26.54,47.24 26.54,45.34 21.97,45.34 21.97,44.32
WDI
  Top 0.152: U1.2 2.29,27.43 | 2.29,27.43 1.98,27.43 R12.1 | 2.29,27.43 2.29,25.7 2.82,25.17 | U10.A12 16.71,16.36 15.67,17.4 12.95,17.4 10.29,20.07 10.29,21.08 8.13,23.24 4.75,23.24 4.47,23.52 2.82,25.17 | TP16.P$1 2.79,25.15 2.82,25.17
XL1
  Top 0.102: U10.D2 17.99,13.61 18.09,13.51 18.09,12.82 17.94,12.67 17.33,12.06 17.33,11.33 X3.A
  Top 0.203: X3.A 17.96,10.55 18.03,10.48 C6.2
XL2
  Top 0.102: U10.F2 18.49,13.61 18.39,13.51 18.39,12.08 X3.B
  Top 0.203: C5.2 18.43,11.73 X3.B

### Text on the board
bPlace: SECONDARY | CR123A / PACK + | CR123A / PACK -
tNames: RESET | SOLAR | VCC | Permamote / Neal Jackson / 10/18 | GND | SOLAR